# EAGLE design harp timestamp generator (EAGLE 9.6.2)
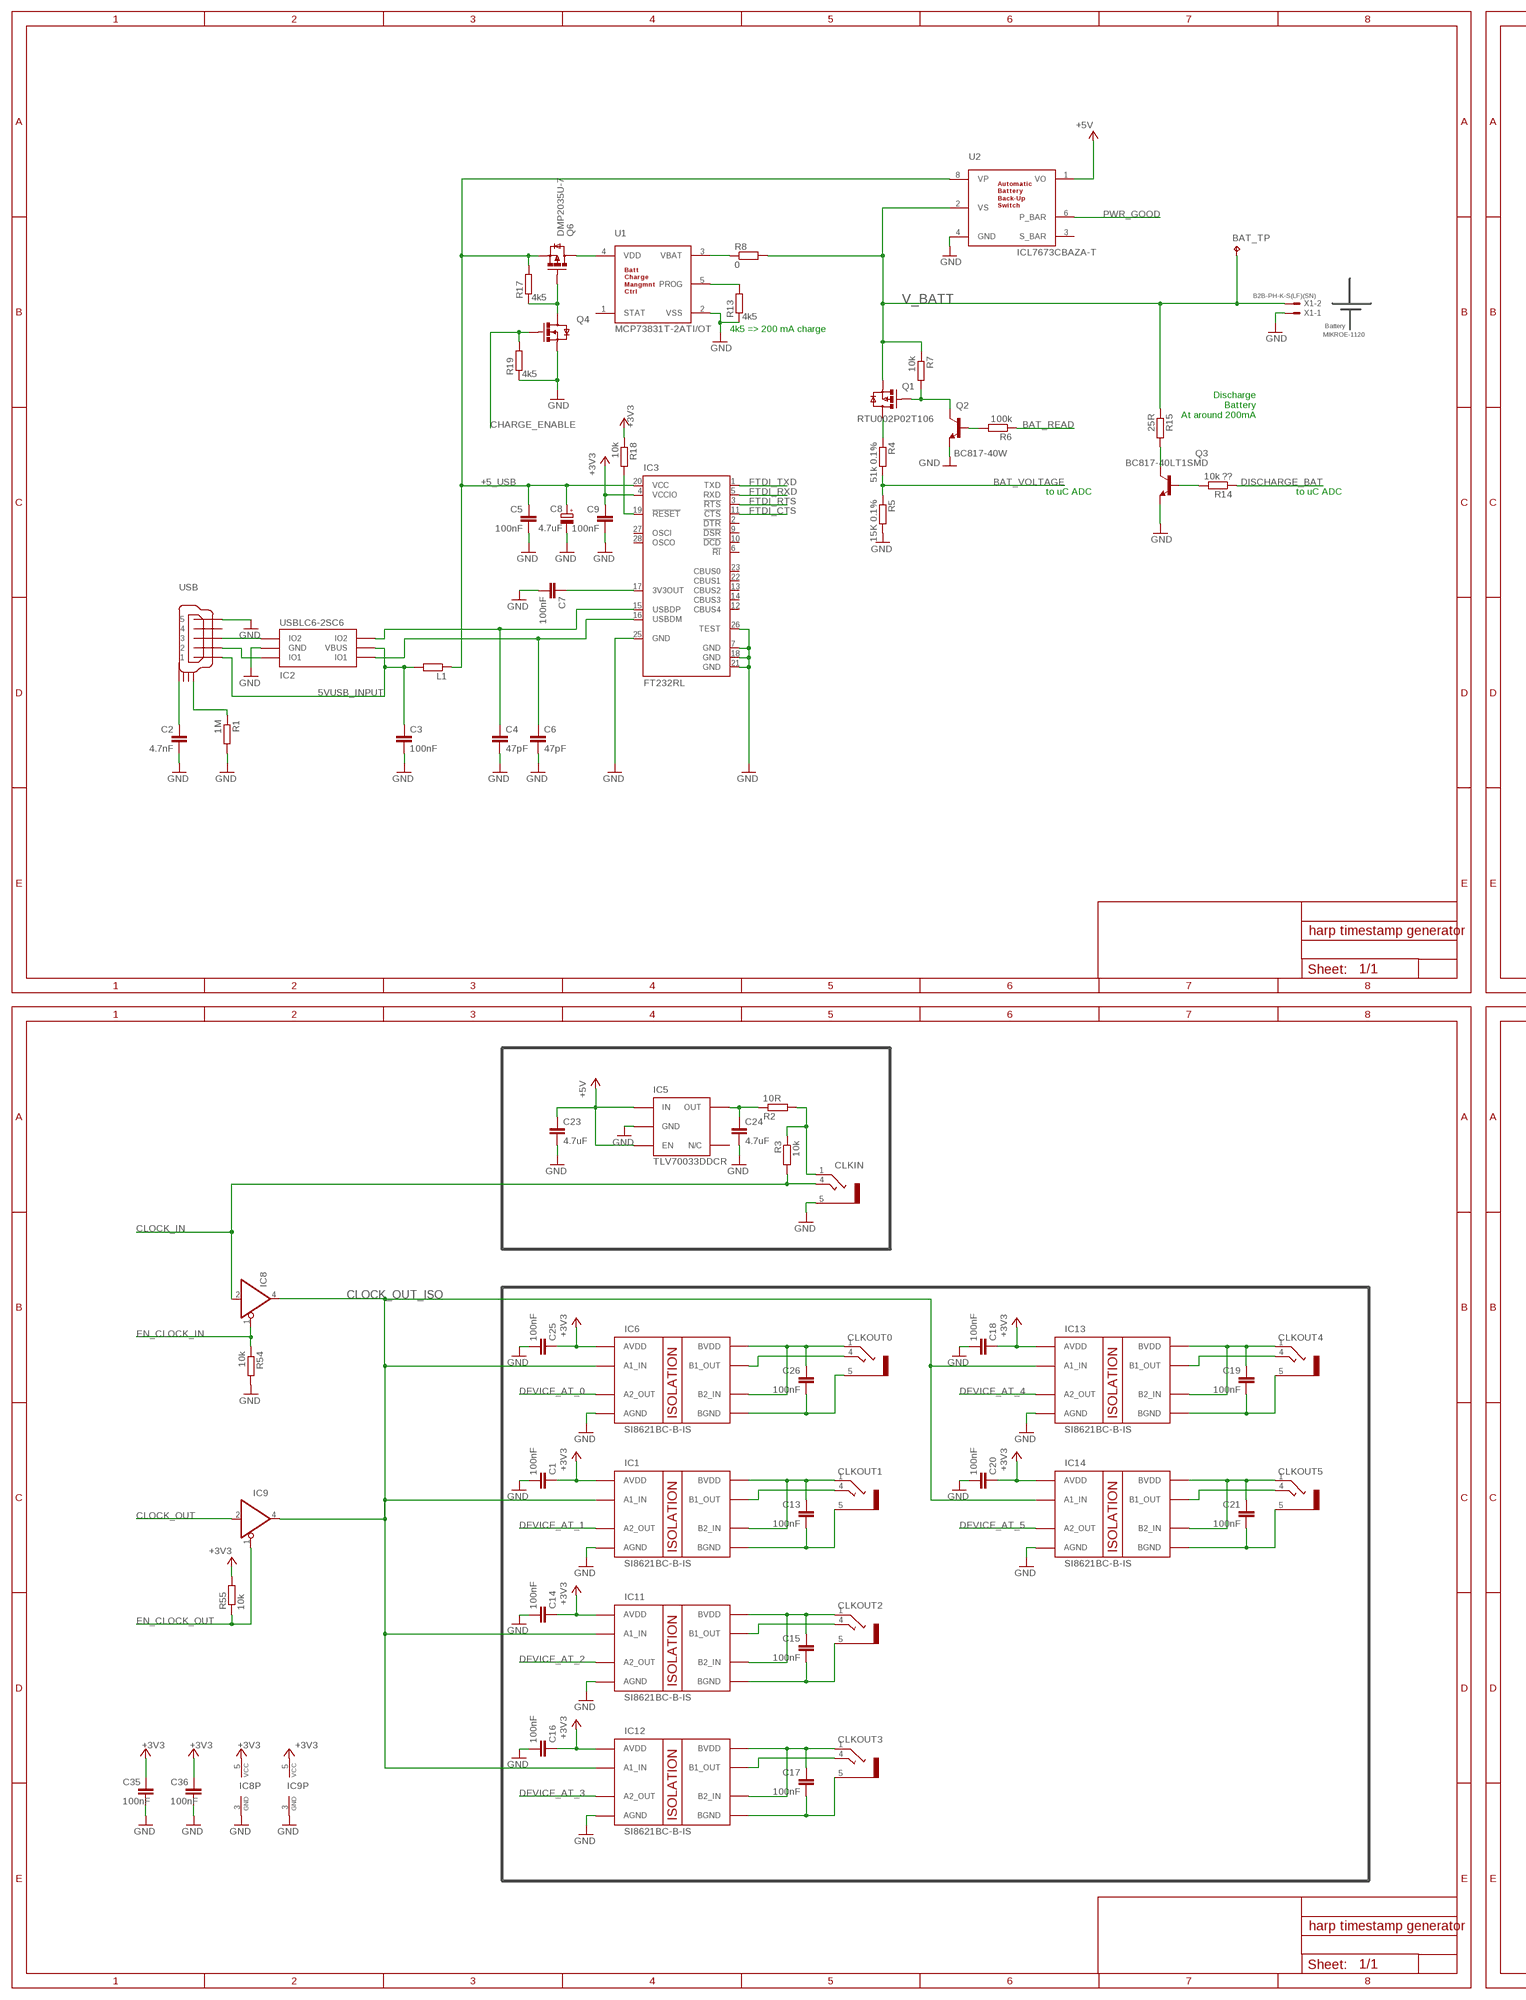
[diagram p0: schematic, sheet 1, part 1 of 3]
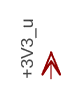
[diagram p1: schematic, sheet 1, part 2 of 3]
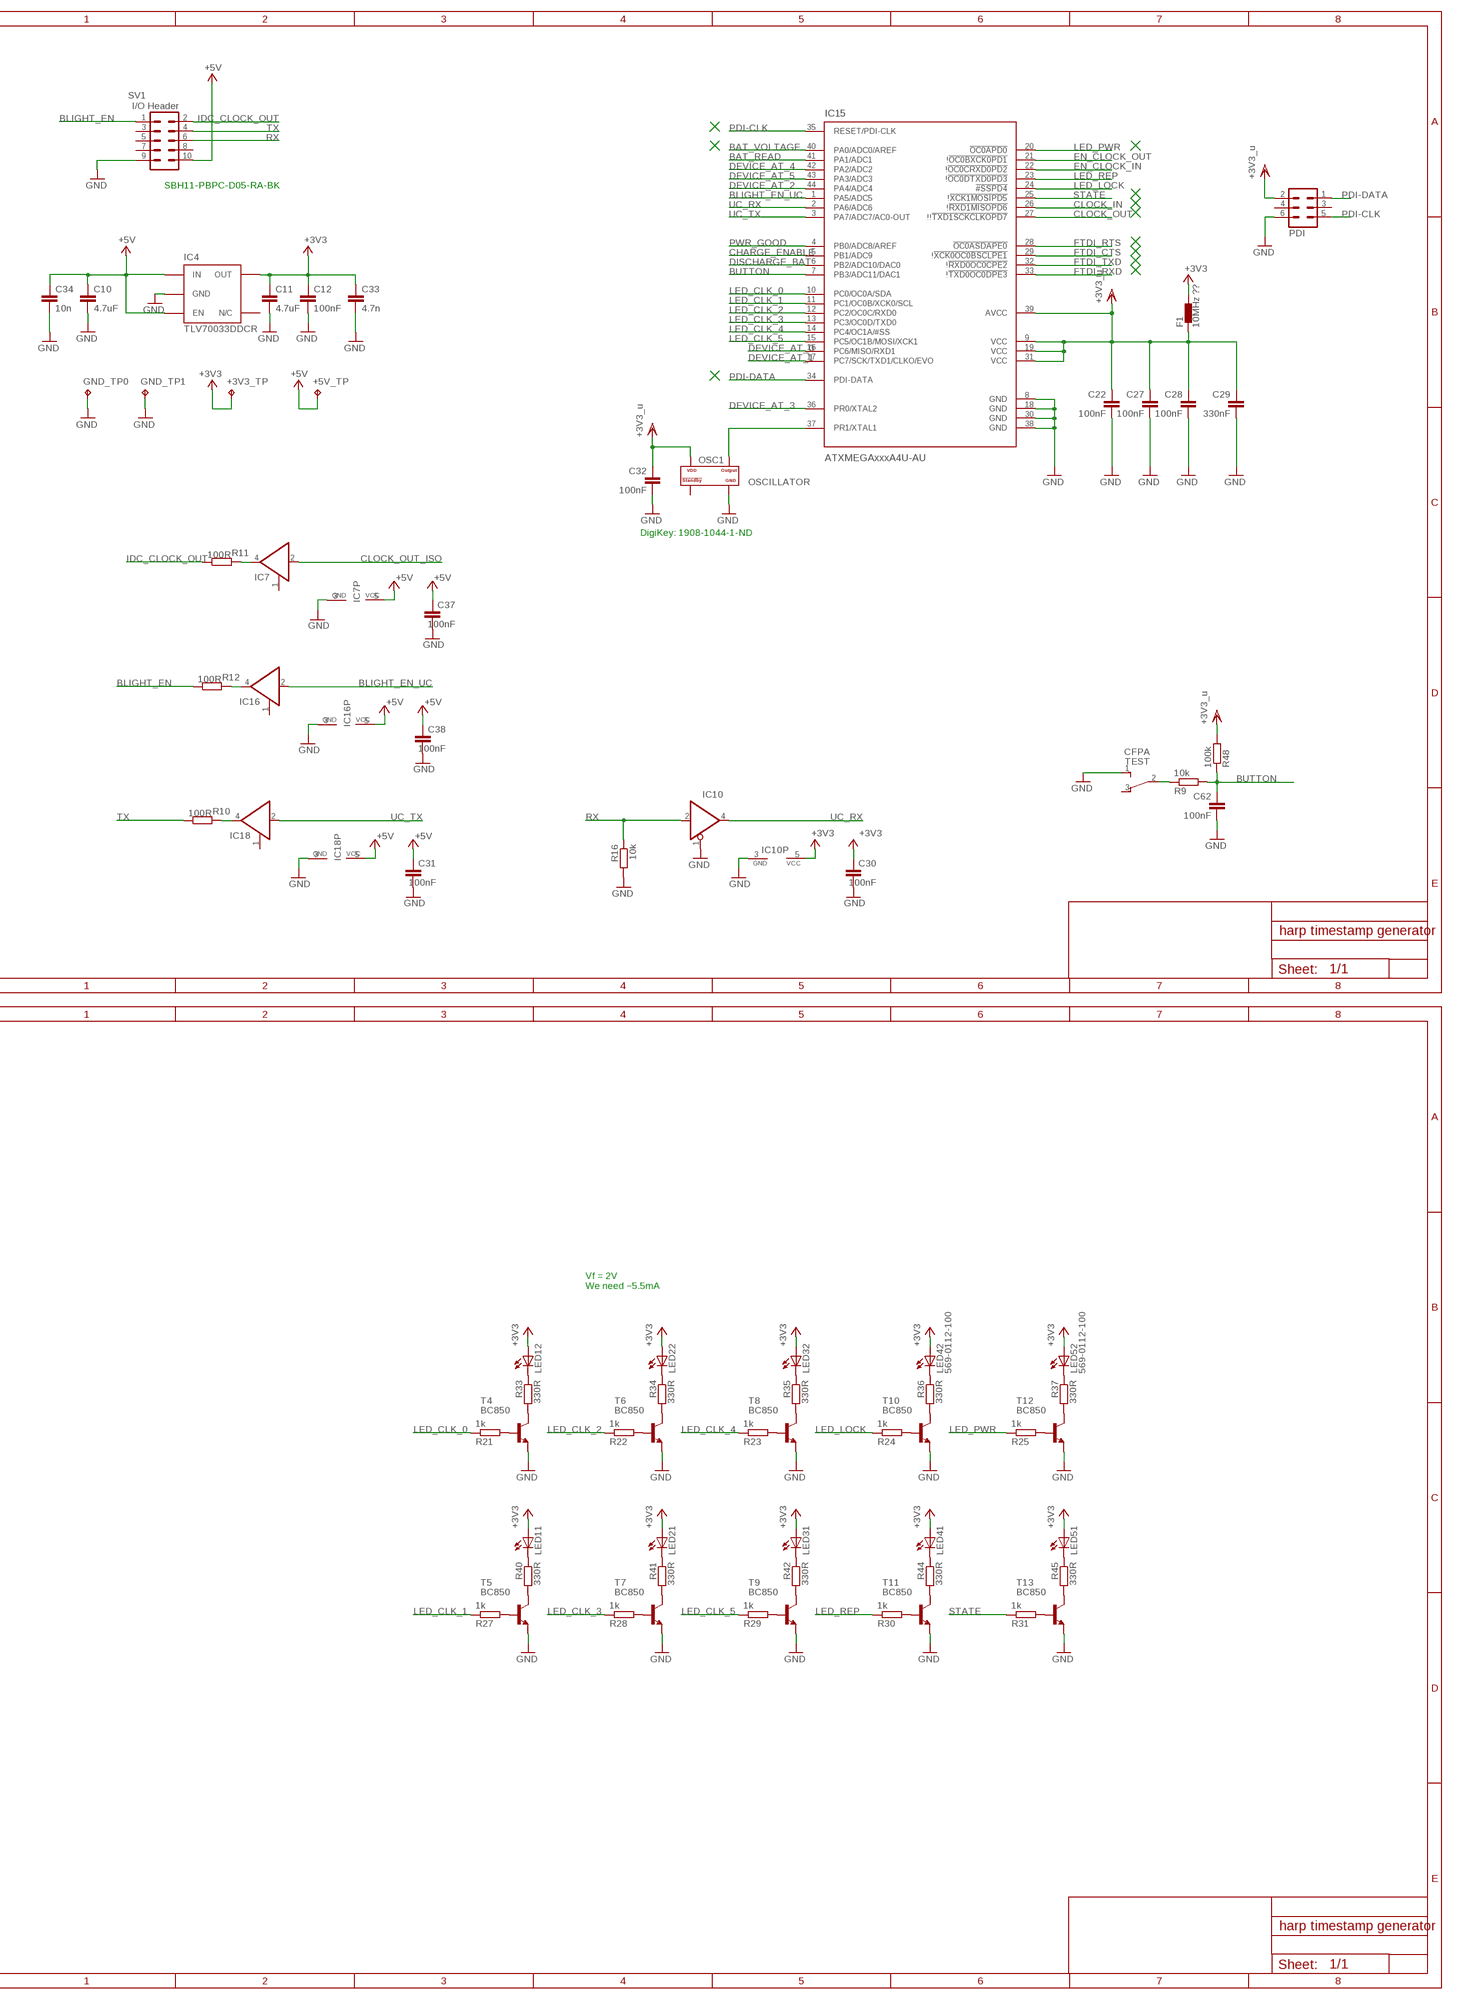
[diagram p2: schematic, sheet 1, part 3 of 3]

## Parts
+3V3_TP  TPPAD1-13  [P1-13]
+5V_TP  TPPAD1-13  [P1-13]
BAT_TP  TPPAD1-13  [P1-13]
C1  100nF  C-EUC0402  [C0402]
C2  4.7nF  C-EUC0402  [C0402]
C3  100nF  C-EUC0402  [C0402]
C4  47pF  C-EUC0402  [C0402]
C5  100nF  C-EUC0402  [C0402]
C6  47pF  C-EUC0402  [C0402]
C7  100nF  C-EUC0402  [C0402]
C8  4.7uF  CPOL-EUA/3216-18W  [A/3216-18W]
C9  100nF  C-EUC0402  [C0402]
C10  4.7uF  C-EUC0603  [C0603]
C11  4.7uF  C-EUC0603  [C0603]
C12  100nF  C-EUC0402  [C0402]
C13  100nF  C-EUC0402  [C0402]
C14  100nF  C-EUC0402  [C0402]
C15  100nF  C-EUC0402  [C0402]
C16  100nF  C-EUC0402  [C0402]
C17  100nF  C-EUC0402  [C0402]
C18  100nF  C-EUC0402  [C0402]
C19  100nF  C-EUC0402  [C0402]
C20  100nF  C-EUC0402  [C0402]
C21  100nF  C-EUC0402  [C0402]
C22  100nF  C-EUC0402  [C0402]
C23  4.7uF  C-EUC0603  [C0603]
C24  4.7uF  C-EUC0603  [C0603]
C25  100nF  C-EUC0402  [C0402]
C26  100nF  C-EUC0402  [C0402]
C27  100nF  C-EUC0402  [C0402]
C28  100nF  C-EUC0402  [C0402]
C29  330nF  C-EUC0402  [C0402]
C30  100nF  C-EUC0402  [C0402]
C31  100nF  C-EUC0402  [C0402]
C32  100nF  C-EUC0402  [C0402]
C33  4.7n  C-EUC0402  [C0402]
C34  10n  C-EUC0402  [C0402]
C35  100nF  C-EUC0402  [C0402]
C36  100nF  C-EUC0402  [C0402]
C37  100nF  C-EUC0402  [C0402]
C38  100nF  C-EUC0402  [C0402]
C62  100nF  C-EUC0402  [C0402]
CLKIN  CLCK_JACK  STEREO_JACK  [35RASMT2BHNTRX]
CLKOUT0  CLCK_JACK  STEREO_JACK  [35RASMT2BHNTRX]
CLKOUT1  CLCK_JACK  STEREO_JACK  [35RASMT2BHNTRX]
CLKOUT2  CLCK_JACK  STEREO_JACK  [35RASMT2BHNTRX]
CLKOUT3  CLCK_JACK  STEREO_JACK  [35RASMT2BHNTRX]
CLKOUT4  CLCK_JACK  STEREO_JACK  [35RASMT2BHNTRX]
CLKOUT5  CLCK_JACK  STEREO_JACK  [35RASMT2BHNTRX]
F1  10MHz ??  BLM15HF0603  [R0603]
GND_TP0  TPPAD1-13  [P1-13]
GND_TP1  TPPAD1-13  [P1-13]
IC1  SI8621BC-B-IS  [SOIC8]
IC2  USBLC6-2SC6  USBLC6-2  [SOT23-6L]
IC3  FT232RL  [SSOP28]
IC4  TLV70033DDCR  TLV700XX  [TSOT23-5]
IC5  TLV70033DDCR  TLV700XX  [TSOT23-5]
IC6  SI8621BC-B-IS  [SOIC8]
IC7  74AHC1G126DCK  [SC70-5]
IC8  SN74LVC1G125DBVT  74AHC1G125DBV  [SOT23-5]
IC9  SN74LVC1G125DBVT  74AHC1G125DBV  [SOT23-5]
IC10  SN74LVC1G125DBVT  74AHC1G125DBV  [SOT23-5]
IC11  SI8621BC-B-IS  [SOIC8]
IC12  SI8621BC-B-IS  [SOIC8]
IC13  SI8621BC-B-IS  [SOIC8]
IC14  SI8621BC-B-IS  [SOIC8]
IC15  ATXMEGAxxxA4U-AU  AT-XMEGA-XXA4-AU  [QFP80P1200X1200X120-44N]
IC16  74AHC1G126DCK  [SC70-5]
IC18  74AHC1G126DCK  [SC70-5]
L1  40R@100MHz  R-EU_R0805  [R0805]
LED1  569-0112-100  LED_2X_VERTICAL  [569-011X-X00_LED_ARRAY]
LED2  569-0112-100  LED_2X_VERTICAL  [569-011X-X00_LED_ARRAY]
LED3  569-0112-100  LED_2X_VERTICAL  [569-011X-X00_LED_ARRAY]
LED4  569-0112-100  LED_2X_VERTICAL  [569-011X-X00_LED_ARRAY]
LED5  569-0112-100  LED_2X_VERTICAL  [569-011X-X00_LED_ARRAY]
OSC1  OSCILLATOR  [OSCILLATOR_3.2X2.5]
PDI  MA03-2  [MA03-2]
Q1  RTU002P02T106  MOSFET-PCHANNEL-ROHM  [SOT323]
Q2  BC817-40W  BC817  [SOT323-BEC]
Q3  BC817-40LT1SMD  [SOT23-BEC]
Q4  DMG1012UW  [SOT323]
Q6  DMP2035U-7  [SOT323]
R1  1M  R-EU_R0402  [R0402]
R2  10R  R-EU_R0402  [R0402]
R3  10k  R-EU_R0402  [R0402]
R4  51k 0.1%  R-EU_R0402  [R0402]
R5  15K 0.1%  R-EU_R0402  [R0402]
R6  100k  R-EU_R0402  [R0402]
R7  10k  R-EU_R0402  [R0402]
R8  0  R-EU_R0402  [R0402]
R9  10k  R-EU_R0402  [R0402]
R10  100R  R-EU_R0603  [R0603]
R11  100R  R-EU_R0603  [R0603]
R12  100R  R-EU_R0603  [R0603]
R13  4k5  R-EU_R0402  [R0402]
R14  10k ??  R-EU_R0402  [R0402]
R15  25R  R-EU_R2512  [R2512]
R16  10k  R-EU_R0402  [R0402]
R17  4k5  R-EU_R0402  [R0402]
R18  10k  R-EU_R0402  [R0402]
R19  4k5  R-EU_R0402  [R0402]
R21  1k  R-EU_R0402  [R0402]
R22  1k  R-EU_R0402  [R0402]
R23  1k  R-EU_R0402  [R0402]
R24  1k  R-EU_R0402  [R0402]
R25  1k  R-EU_R0402  [R0402]
R27  1k  R-EU_R0402  [R0402]
R28  1k  R-EU_R0402  [R0402]
R29  1k  R-EU_R0402  [R0402]
R30  1k  R-EU_R0402  [R0402]
R31  1k  R-EU_R0402  [R0402]
R33  330R  R-EU_R0402  [R0402]
R34  330R  R-EU_R0402  [R0402]
R35  330R  R-EU_R0402  [R0402]
R36  330R  R-EU_R0402  [R0402]
R37  330R  R-EU_R0402  [R0402]
R40  330R  R-EU_R0402  [R0402]
R41  330R  R-EU_R0402  [R0402]
R42  330R  R-EU_R0402  [R0402]
R44  330R  R-EU_R0402  [R0402]
R45  330R  R-EU_R0402  [R0402]
R48  100k  R-EU_R0402  [R0402]
R54  10k  R-EU_R0402  [R0402]
R55  10k  R-EU_R0402  [R0402]
SV1  I/O Header  ML10L  [ML10L]
T4  BC850  [SOT23]
T5  BC850  [SOT23]
T6  BC850  [SOT23]
T7  BC850  [SOT23]
T8  BC850  [SOT23]
T9  BC850  [SOT23]
T10  BC850  [SOT23]
T11  BC850  [SOT23]
T12  BC850  [SOT23]
T13  BC850  [SOT23]
TEST  CFPA  SPDT_CFPA  [CFPA]
U1  MCP73831T-2ATI/OT  [TSOT23-5]
U2  ICL7673CBAZA-T  [SOIC8]
USB  mini USB  USB_MINI_B  [240-0002-1]
X1  B2B-PH-K-S(LF)(SN)  JST-XH-02-PIN-ROUND-PAD  [JST-XH-02-PACKAGE-ROUND-PAD]

## Nets
5VUSB_INPUT: C3.1 IC2.P$5(VBUS) L1.2 USB.P$1
+3V3: +3V3_TP.TP C1.1 C9.1 C11.1 C12.1 C14.1 C16.1 C18.1 C20.1 C25.1 C30.1 C33.1 C35.1 C36.1 F1.2 IC1.1(AVDD) IC3.4(VCCIO) IC4.5(OUT) IC6.1(AVDD) IC8.5(VCC) IC9.5(VCC) IC10.5(VCC) IC11.1(AVDD) IC12.1(AVDD) IC13.1(AVDD) IC14.1(AVDD) LED1.A1(1:A) LED1.A2(2:A) LED2.A1(1:A) LED2.A2(2:A) LED3.A1(1:A) LED3.A2(2:A) LED4.A1(1:A) LED4.A2(2:A) LED5.A1(1:A) LED5.A2(2:A) R18.1 R55.2
+5_USB: C5.1 C8.+ IC3.20(VCC) L1.1 Q6.1(S) R17.2 U2.8(VP)
+5V: +5V_TP.TP C10.1 C23.1 C31.1 C34.1 C37.1 C38.1 IC4.1(IN) IC4.3(EN) IC5.1(IN) IC5.3(EN) IC7.5(VCC) IC16.5(VCC) IC18.5(VCC) SV1.10 U2.1(VO)
BAT_READ: IC15.41(PA1/ADC1) R6.1
BAT_VOLTAGE: IC15.40(PA0/ADC0/AREF) R4.2 R5.1
BLIGHT_EN: R12.1 SV1.1
BLIGHT_EN_UC: IC15.1(PA5/ADC5) IC16.2(I)
BUTTON: C62.1 IC15.7(PB3/ADC11/DAC1) R9.2 R48.1
CHARGE_ENABLE: IC15.5(PB1/ADC9) Q4.2(G) R19.2
CLKOUT0: CLKOUT0.4 IC6.7(B1_OUT)
CLKOUT1: CLKOUT1.4 IC1.7(B1_OUT)
CLKOUT2: CLKOUT2.4 IC11.7(B1_OUT)
CLKOUT3: CLKOUT3.4 IC12.7(B1_OUT)
CLKOUT4: CLKOUT4.4 IC13.7(B1_OUT)
CLKOUT5: CLKOUT5.4 IC14.7(B1_OUT)
CLOCK_IN: CLKIN.4 IC8.2(I) IC15.26(!!RXD1MISOPD6) R3.2
CLOCK_OUT: IC9.2(I) IC15.27(!!!TXD1SCKCLKOPD7)
CLOCK_OUT_ISO: IC1.2(A1_IN) IC6.2(A1_IN) IC7.2(I) IC8.4(O) IC9.4(O) IC11.2(A1_IN) IC12.2(A1_IN) IC13.2(A1_IN) IC14.2(A1_IN)
DEVICE_AT_0: IC6.3(A2_OUT) IC15.16(PC6/MISO/RXD1)
DEVICE_AT_1: IC1.3(A2_OUT) IC15.17(PC7/SCK/TXD1/CLKO/EVO)
DEVICE_AT_2: IC11.3(A2_OUT) IC15.44(PA4/ADC4)
DEVICE_AT_3: IC12.3(A2_OUT) IC15.36(PR0/XTAL2)
DEVICE_AT_4: IC13.3(A2_OUT) IC15.42(PA2/ADC2)
DEVICE_AT_5: IC14.3(A2_OUT) IC15.43(PA3/ADC3)
DISCHARGE_BAT: IC15.6(PB2/ADC10/DAC0) R14.1
EN_CLOCK_IN: IC8.1(OE) IC15.22(!!OC0CRXD0PD2) R54.1
EN_CLOCK_OUT: IC9.1(OE) IC15.21(!!OC0BXCK0PD1) R55.1
FTDI_CTS: IC3.11(!CTS) IC15.29(!!XCK0OC0BSCLPE1)
FTDI_RTS: IC3.3(!RTS) IC15.28(!OC0ASDAPE0)
FTDI_RXD: IC3.5(RXD) IC15.33(!!TXD0OC0DPE3)
FTDI_TXD: IC3.1(TXD) IC15.32(!!RXD0OC0CPE2)
GND: C1.2 C2.2 C3.2 C4.2 C5.2 C6.2 C7.2 C8.- C9.2 C10.2 C11.2 C12.2 C14.2 C16.2 C18.2 C20.2 C22.2 C23.2 C24.2 C25.2 C27.2 C28.2 C29.2 C30.2 C31.2 C32.2 C33.2 C34.2 C35.2 C36.2 C37.2 C38.2 C62.2 CLKIN.5 GND_TP0.TP GND_TP1.TP IC1.4(AGND) IC2.P$2(GND) IC3.7(GND) IC3.18(GND) IC3.21(GND) IC3.25(GND) IC3.26(TEST) IC4.2(GND) IC5.2(GND) IC6.4(AGND) IC7.3(GND) IC8.3(GND) IC9.3(GND) IC10.1(OE) IC10.3(GND) IC11.4(AGND) IC12.4(AGND) IC13.4(AGND) IC14.4(AGND) IC15.8(GND) IC15.18(GND) IC15.30(GND) IC15.38(GND) IC16.3(GND) IC18.3(GND) OSC1.P$2(GND) PDI.6 Q2.E Q3.E Q4.1(S) R1.2 R5.2 R13.1 R16.2 R19.1 R54.2 SV1.9 T4.2(E) T5.2(E) T6.2(E) T7.2(E) T8.2(E) T9.2(E) T10.2(E) T11.2(E) T12.2(E) T13.2(E) TEST.1 U1.2(VSS) U2.4(GND) USB.P$5 X1.1
GND_ISO: C26.2 CLKOUT0.5 IC6.5(BGND)
GND_ISO1: C13.2 CLKOUT1.5 IC1.5(BGND)
GND_ISO2: C15.2 CLKOUT2.5 IC11.5(BGND)
GND_ISO3: C17.2 CLKOUT3.5 IC12.5(BGND)
GND_ISO4: C19.2 CLKOUT4.5 IC13.5(BGND)
GND_ISO5: C21.2 CLKOUT5.5 IC14.5(BGND)
IDC_CLOCK_OUT: R11.1 SV1.2
LED_CLK_0: IC15.10(PC0/OC0A/SDA) R21.1
LED_CLK_1: IC15.11(PC1/OC0B/XCK0/SCL) R27.1
LED_CLK_2: IC15.12(PC2/OC0C/RXD0) R22.1
LED_CLK_3: IC15.13(PC3/OC0D/TXD0) R28.1
LED_CLK_4: IC15.14(PC4/OC1A/#SS) R23.1
LED_CLK_5: IC15.15(PC5/OC1B/MOSI/XCK1) R29.1
LED_LOCK: IC15.24(!#SSPD4) R24.1
LED_PWR: IC15.20(!OC0APD0) R25.1
LED_REP: IC15.23(!!OC0DTXD0PD3) R30.1
N$1: R24.2 T10.1(B)
N$2: Q4.3(D) Q6.2(G) R17.1
N$3: IC16.4(O) R12.2
N$4: IC18.4(O) R10.2
N$5: C26.1 CLKOUT0.1 IC6.6(B2_IN) IC6.8(BVDD)
N$6: C13.1 CLKOUT1.1 IC1.6(B2_IN) IC1.8(BVDD)
N$7: R36.2 T10.3(C)
N$8: IC7.4(O) R11.2
N$10: Q6.3(D) U1.4(VDD)
N$11: C15.1 CLKOUT2.1 IC11.6(B2_IN) IC11.8(BVDD)
N$15: R22.2 T6.1(B)
N$16: R13.2 U1.5(PROG)
N$17: R21.2 T4.1(B)
N$18: LED3.C1(1:C) R42.1
N$19: R33.2 T4.3(C)
N$20: R27.2 T5.1(B)
N$21: R34.2 T6.3(C)
N$22: R40.2 T5.3(C)
N$23: LED3.C2(2:C) R35.1
N$24: R28.2 T7.1(B)
N$25: R41.2 T7.3(C)
N$26: R23.2 T8.1(B)
N$27: R35.2 T8.3(C)
N$28: R29.2 T9.1(B)
N$29: R42.2 T9.3(C)
N$30: LED1.C2(2:C) R33.1
N$31: LED2.C2(2:C) R34.1
N$32: LED1.C1(1:C) R40.1
N$33: LED2.C1(1:C) R41.1
N$34: R30.2 T11.1(B)
N$35: Q3.B R14.2
N$36: Q3.C R15.2
N$37: C17.1 CLKOUT3.1 IC12.6(B2_IN) IC12.8(BVDD)
N$38: C7.1 IC3.17(3V3OUT)
N$40: IC2.P$1(IO1) USB.P$2
N$41: CLKIN.1 R2.2 R3.1
N$42: C24.1 IC5.5(OUT) R2.1
N$43: R9.1 TEST.2
N$45: C19.1 CLKOUT4.1 IC13.6(B2_IN) IC13.8(BVDD)
N$47: R44.2 T11.3(C)
N$49: C21.1 CLKOUT5.1 IC14.6(B2_IN) IC14.8(BVDD)
N$50: IC2.P$3(IO2) USB.P$3
N$53: R25.2 T12.1(B)
N$54: R37.2 T12.3(C)
N$56: R31.2 T13.1(B)
N$59: C2.1 USB.SHIELD_4
N$60: R45.2 T13.3(C)
N$61: R1.1 USB.SHIELD_1
N$62: LED5.C1(1:C) R45.1
N$63: LED5.C2(2:C) R37.1
N$65: LED4.C2(2:C) R36.1
N$66: LED4.C1(1:C) R44.1
N$97: R8.1 U1.3(VBAT)
N$113: Q1.3(D) R4.1
N$116: Q1.2(G) Q2.C R7.2
N$118: Q2.B R6.2
N$175: IC3.19(!RESET) R18.2
OSC1: IC15.37(PR1/XTAL1) OSC1.P$3(OUTPUT)
PDI-CLK: IC15.35(RESET/PDI-CLK) PDI.5
PDI-DATA: IC15.34(PDI-DATA) PDI.1
PWR_GOOD: IC15.4(PB0/ADC8/AREF) U2.6(P_BAR)
RX: IC10.2(I) R16.1 SV1.6
STATE: IC15.25(!!XCK1MOSIPD5) R31.1
TX: R10.1 SV1.4
UC_RX: IC10.4(O) IC15.2(PA6/ADC6)
UC_TX: IC15.3(PA7/ADC7/AC0-OUT) IC18.2(I)
USBDM: C6.1 IC2.P$6(IO1) IC3.16(USBDM)
USBDP: C4.1 IC2.P$4(IO2) IC3.15(USBDP)
V_BATT: BAT_TP.TP Q1.1(S) R7.1 R8.2 R15.1 U2.2(VS) X1.2
VDD: C22.1 C27.1 C28.1 C29.1 C32.1 F1.1 IC15.9(VCC) IC15.19(VCC) IC15.31(VCC) IC15.39(AVCC) OSC1.P$4(VDD) PDI.2 R48.2 ; supply symbol labelled +3V3_u
Unconnected: IC3.2(!DTR) IC3.6(!RI) IC3.9(!DSR) IC3.10(!DCD) IC3.12(CBUS4) IC3.13(CBUS2) IC3.14(CBUS3) IC3.22(CBUS1) IC3.23(CBUS0) IC3.27(OSCI) IC3.28(OSCO) IC4.4(N/C) IC5.4(N/C) IC7.1(OE) IC16.1(OE) IC18.1(OE) OSC1.P$1(STANDBY#) PDI.3 PDI.4 SV1.3 SV1.5 SV1.7 SV1.8 TEST.3 U1.1(STAT) U2.3(S_BAR) U2.5(NC5) U2.7(NC7) USB.P$4 USB.SHIELD_2 USB.SHIELD_3

## Notes on the sheet
- SBH11-PBPC-D05-RA-BK
- Battery
- 4k5 => 200 mA charge
- MIKROE-1120
- Discharge
  Battery
  At around 200mA
- to uC ADC | to uC ADC
- DigiKey: 1908-1044-1-ND
- Vf = 2V
  We need ~5.5mA

## Library data of the parts
+3V3_TP +5V_TP BAT_TP GND_TP0 GND_TP1 = testpad:TP: Test pad; MPN: n.a.
C1 C3 C5 C7 C9 C12-C21 C25 C26 C30 C31 C35-C38 = rcl:C-EU: CAPACITOR, European symbol; MPN: MC0402B104K160CT
C2 = rcl:C-EU: CAPACITOR, European symbol; MPN: 885012205084
C4 C6 = rcl:C-EU: CAPACITOR, European symbol; MPN: 04025A470JAT2A
C8 = rcl:CPOL-EU: POLARIZED CAPACITOR, European symbol; MPN: TAJA475K016UNJ
C10 C11 C23 C24 = rcl:C-EU: CAPACITOR, European symbol; MPN: C1608X6S1C475K080AC
C22 C27-C29 C32 C62 = rcl:C-EU: CAPACITOR, European symbol
C33 C34 = rcl:C-EU: CAPACITOR, European symbol; MPN: ??
CLKIN CLKOUT0 CLKOUT1-CLKOUT5 = harp timestamp generator:STEREO_JACK; MPN: 35RASMT2BHNTRX
F1 = harp timestamp generator:BLM15H: EMIFIL (R) Chip Ferrite Bead for GHz Noise Source: http://www.murata.com/ Ferrite Bead BLM15H.pdf
IC1 IC6 IC11-IC14 = harp timestamp generator:SI8621BC-B-IS; MPN: Si8621BC-B-IS
IC2 = harp timestamp generator:USBLC6-2; MPN: USBLC6-2SC6
IC3 = harp timestamp generator:FT232R: UART/FIFO IC; MPN: FT232RL-REEL
IC4 IC5 = harp timestamp generator:TLV700XX; MPN: TLV70033DDCR
IC7 IC16 IC18 = 74xx-little-de:74*1G126: Single Bus Buffer Gate With 3-State Outputs
IC8-IC10 = 74xx-little-de:74*1G125: Single Bus Buffer Gate with 3-State Output; MPN: SN74LVC1G125DBVT
IC15 = harp timestamp generator:AT-XMEGA-XXA4-AU: ATxMega a4 Serie
L1 = rcl:R-EU_: RESISTOR, European symbol; MPN: MI0805K400R-10
LED1-LED5 = harp timestamp generator:LED_2X; MPN: 5690-111-100F
OSC1 = harp timestamp generator:OSCILLATOR
PDI = con-lstb:MA03-2: PIN HEADER; OC_FARNELL: unknown; OC_NEWARK: unknown
Q1 = harp timestamp generator:MOSFET-PCHANNEL-ROHM: PMOS (RTU002P02) Low On-Resistance. Low Gate Threshold Voltage. Low Input Capacitance. Fast Switching Speed. Manufacturer: ROHM
Q2 Q3 = transistor-npn:BC817*: NPN Transistor
Q4 = harp timestamp generator:DMG1012UW: DMG1012UW N-channel MOSFET Drain Source Voltage Vds: 20V Continuous Drain Current Id: 1A On Resistance Rds(on): 0.3ohm Transistor Case Style: SOT-323 Transistor Mounting: Surface Mount Rds(on) Test Voltage Vgs: 4.5V; MPN: DMG1012UW
Q6 = harp timestamp generator:DMP2035U-7: DMP2035U Diode Inc surface mount, P channel enhancement mode MOSFET in SOT-23 package This device features low on resistance, low input capacitance, fast switching speed and low input/output leakage thus it is ideal for high efficiency power management applications. Drain to source Voltage (Vds) of -20V Gate to source voltage (Vgs) of ±8V Continuous drain current (Id) -3.6A to 25°C Power dissipation (Pd) of 810mW Operating temperature range -55°C to 150°C Low on state resistance of 41mohm at Vgs -1.8V; MPN: DMP2035U-7
R1 = rcl:R-EU_: RESISTOR, European symbol; MPN: CRCW04021M00FKED
R2 = rcl:R-EU_: RESISTOR, European symbol; MPN: CRCW040210R0FKEDHP
R3-R8 R16 R18 R54 R55 = rcl:R-EU_: RESISTOR, European symbol; MPN: CRCW040210K0FKED
R9 R48 = rcl:R-EU_: RESISTOR, European symbol
R10-R12 = rcl:R-EU_: RESISTOR, European symbol; MPN: CRCW0603100RFKEAHP
R13 R17 R19 = rcl:R-EU_: RESISTOR, European symbol; MPN: 22k !!!
R14 R15 = rcl:R-EU_: RESISTOR, European symbol; MPN: ???
R21-R25 R27-R31 = rcl:R-EU_: RESISTOR, European symbol; MPN: CRCW04021K00FKED
R33-R37 R40-R42 R44 R45 = rcl:R-EU_: RESISTOR, European symbol; MPN: RC0402FR-07330RL
SV1 = harp timestamp generator:ML10L: HARTING; MPN: SBH11-PBPC-D05-RA-BK
T4-T13 = transistor:BC850: NPN TRANSISTOR; MPN: BC850C,215
TEST = harp timestamp generator:SPDT: SPDT Switch
U1 = harp timestamp generator:MCP73831T-2ATI/OT: Miniature Single-Cell, Fully Integrated Li-Ion, Li-Polymer Charge Management Controllers; MPN: MCP73831T-2ATI/OT
U2 = harp timestamp generator:ICL7673CBAZA-T
USB = harp timestamp generator:USB_MINI_B; MPN: UX60-MB-5S8
X1 = harp timestamp generator:JST-XH-02-PIN: JST XH Connector 2 Pin Wire to board connector. Pitch: 2,54 mm, (0.100") Number of pins: 2 Created by Rembrandt Electronics www.rembrandtelectronics.com

## Net classes
0 default: clearance 0.205 mm

## Board
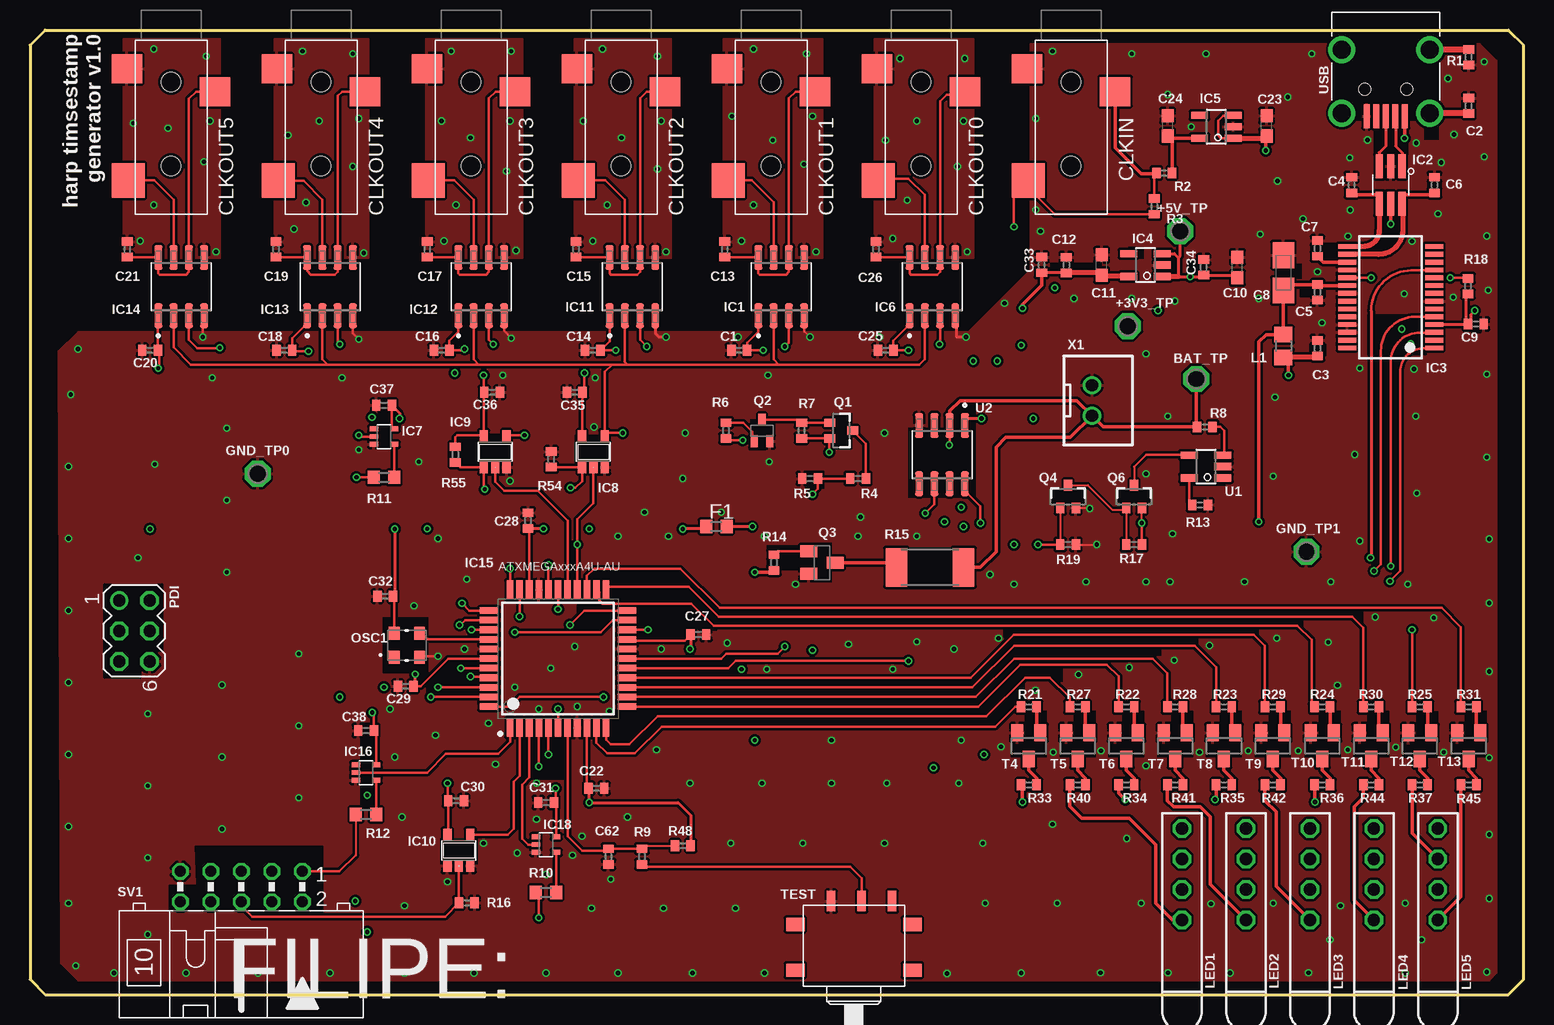
[diagram p3: board, top side]
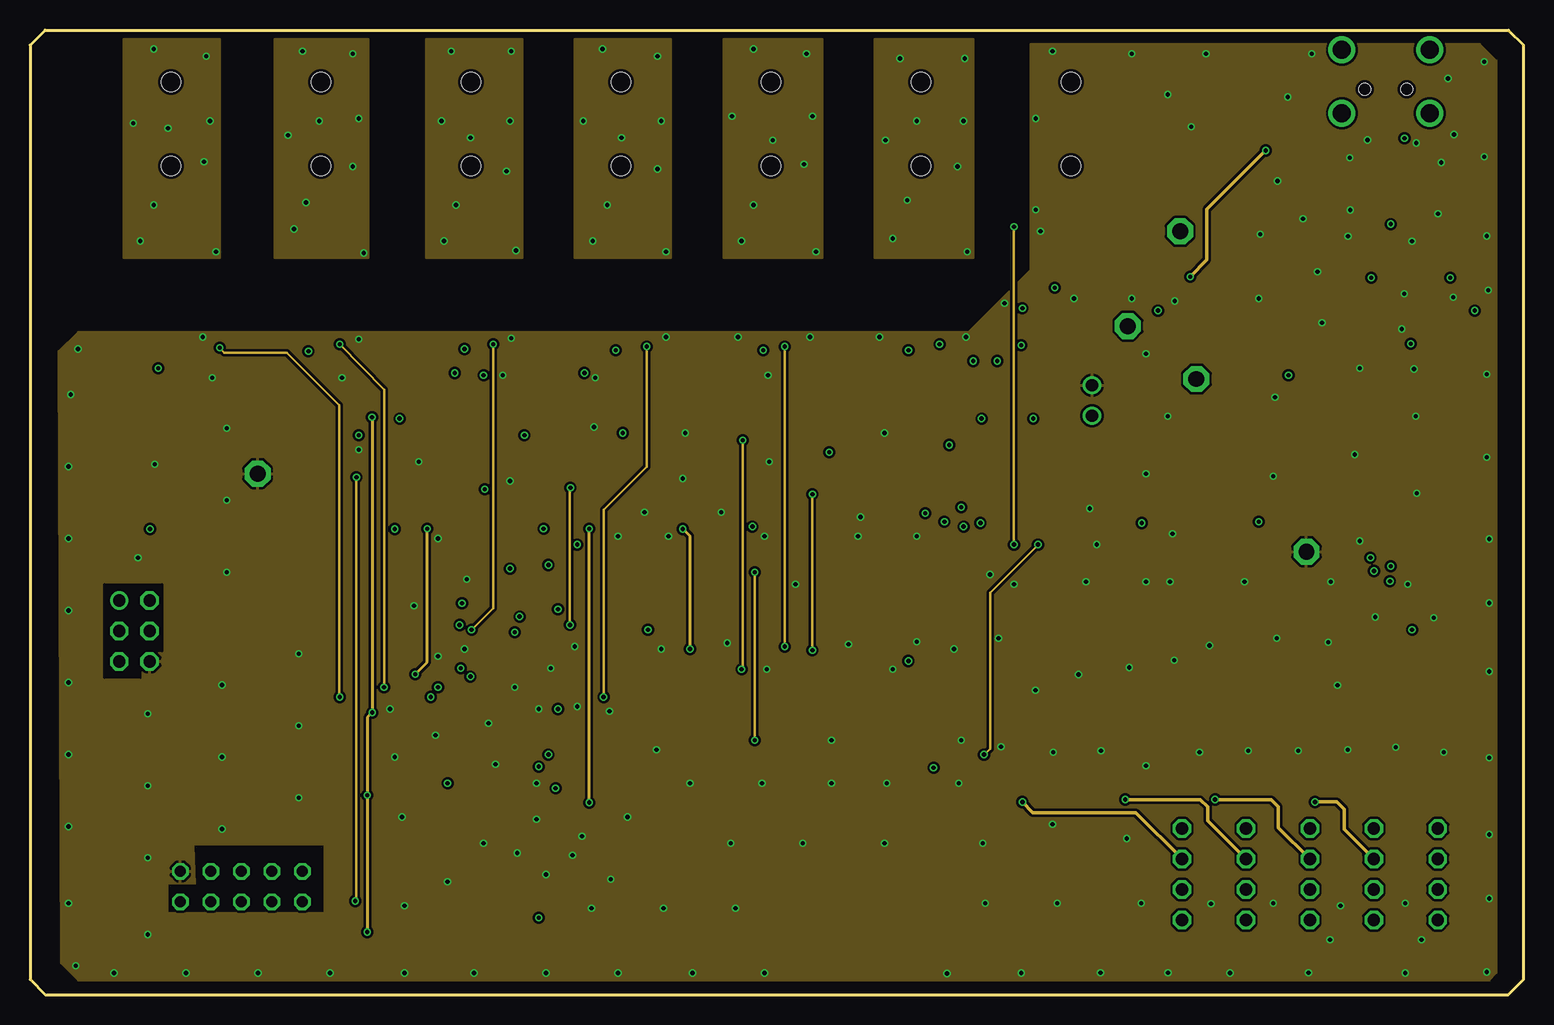
[diagram p4: board, inner layer Layer2]
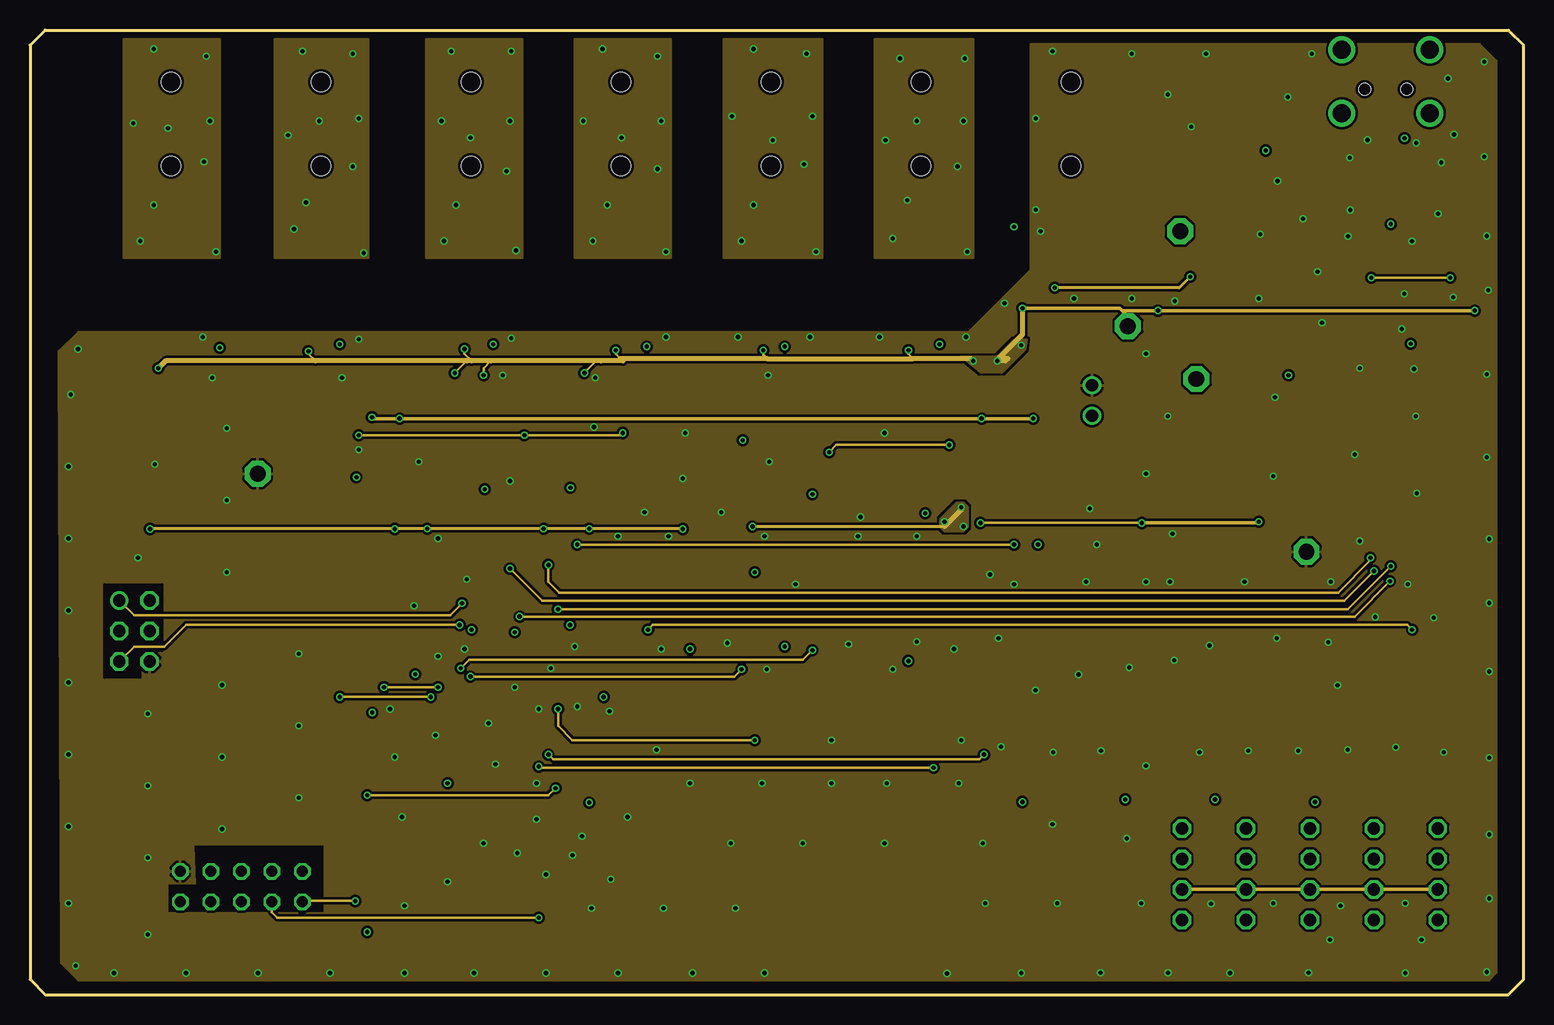
[diagram p5: board, inner layer Layer3]
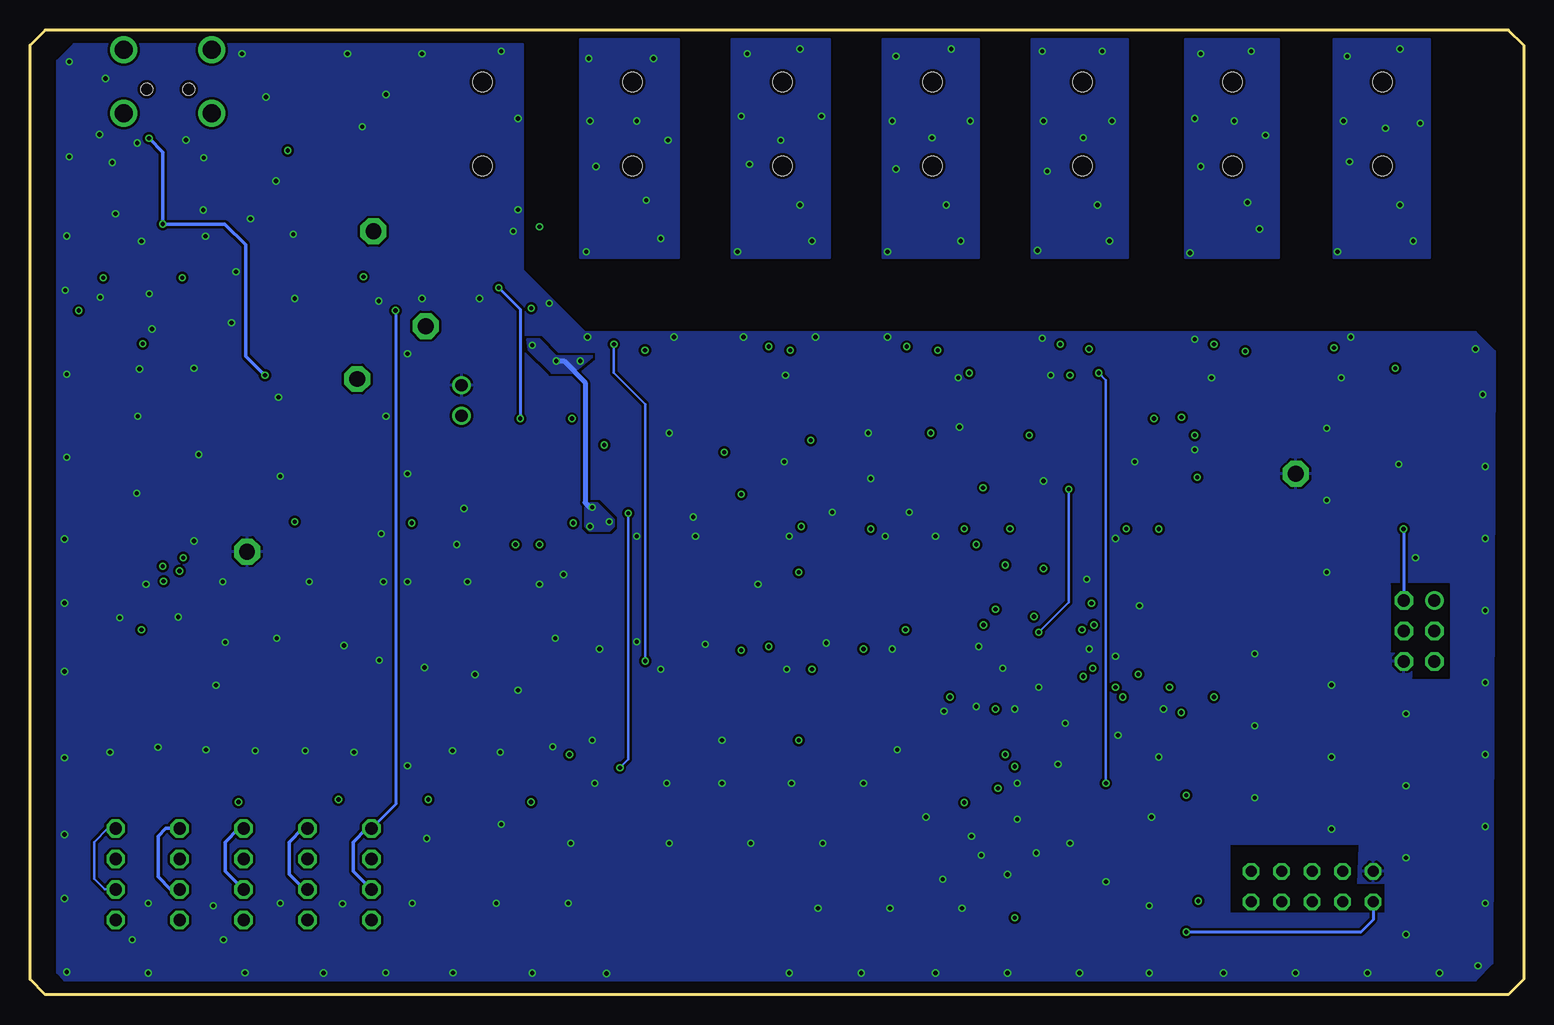
[diagram p6: board, bottom side, seen from below]

Size 124.46 x 80.38 mm. Coordinates in mm from the lower left corner, seen from the top.
Outline: 0,79.11 0,1.27 1.27,0 123.19,0 124.46,1.27 124.46,79.11 123.19,80.38 1.27,80.38 0,79.11
Copper layers (1+2*15+16): Top 0.018mm / dielectric 0.36mm / Layer2 0.035mm / dielectric 0.71mm / Layer3 0.035mm / dielectric 0.2mm / Bottom 0.018mm
Design rules "harp PCB design rules *": minimum track width 0.15mm, minimum drill 0.35mm, track to track 6mil, track to pad 6mil, pad to pad 6mil, via to via 6mil, smd to smd 6mil, copper to edge 0.25mm, drill to drill 0.35mm, minimum pad ring 0.175mm, minimum via ring 0.125mm, stop-mask expansion 0mil, vias tented up to drill 0.45mm, thermal gap 0.2mm
tKeepout: area 0,-0.5 to 2.5,79.5; area 122.4,0.5 to 125,80.5
bKeepout: area 122.4,0.5 to 125,80.5

### Footprints (pad centres in the part's own frame; a part is rotated, then mirrored left to right if it is on the bottom)
P1-13 = drill 1.321 pad 2.159 octagon: TP 0,0
C0402 = smd 0.7 x 0.9: 1 -0.65,0; 2 0.65,0
A/3216-18W = smd 2.15 x 1.8: + 1.475,0; - -1.475,0
C0603 = smd 1.1 x 1: 1 -0.85,0; 2 0.85,0
35RASMT2BHNTRX = smd 2.4 x 2.55: 1 0.8,3.675; 5 -1.1,-3.675 | smd 2.9 x 2.75: 4 8.2,-3.575 | hole 1.6: 0,0; 7,0
R0603 = smd 1 x 1.1: 1 -0.85,0; 2 0.85,0
SOIC8 = smd 0.67 x 2.07: 1 -1.905,-2.425; 2 -0.635,-2.425; 3 0.635,-2.425; 4 1.905,-2.425; 5 1.905,2.425; 6 0.635,2.425; 7 -0.635,2.425; 8 -1.905,2.425
SOT23-6L = smd 0.6 x 2: P$1 -0.95,-1.55; P$2 0,-1.55; P$3 0.95,-1.55; P$4 0.95,1.55; P$5 0,1.55; P$6 -0.95,1.55
SSOP28 = smd 0.4 x 1.5: 1 -4.225,-3.625; 2 -3.575,-3.625; 3 -2.925,-3.625; 4 -2.275,-3.625; 5 -1.625,-3.625; 6 -0.975,-3.625; 7 -0.325,-3.625; 8 0.325,-3.625; 9 0.975,-3.625; 10 1.625,-3.625; 11 2.275,-3.625; 12 2.925,-3.625; 13 3.575,-3.625; 14 4.225,-3.625; 15 4.225,3.625; 16 3.575,3.625; 17 2.925,3.625; 18 2.275,3.625; 19 1.625,3.625; 20 0.975,3.625; 21 0.325,3.625; 22 -0.325,3.625; 23 -0.975,3.625; 24 -1.625,3.625; 25 -2.275,3.625; 26 -2.925,3.625; 27 -3.575,3.625; 28 -4.225,3.625
TSOT23-5 = smd 0.6 x 1.408: 1 -0.95,-1.404; 2 0,-1.404; 3 0.95,-1.404; 4 0.95,1.404; 5 -0.95,1.404
SC70-5 = smd 0.4 x 0.7: 1 -0.65,-0.85; 2 0,-0.85; 3 0.65,-0.85; 4 0.65,0.85; 5 -0.65,0.85
SOT23-5 = smd 0.69 x 0.99: 1 -0.95,-1.29; 2 0,-1.29; 3 0.95,-1.29; 4 0.95,1.3; 5 -0.95,1.3
QFP80P1200X1200X120-44N = smd 1.55 x 0.55: 1 -5.75,4; 2 -5.75,3.2; 3 -5.75,2.4; 4 -5.75,1.6; 5 -5.75,0.8; 6 -5.75,0; 7 -5.75,-0.8; 8 -5.75,-1.6; 9 -5.75,-2.4; 10 -5.75,-3.2; 11 -5.75,-4; 23 5.75,-4; 24 5.75,-3.2; 25 5.75,-2.4; 26 5.75,-1.6; 27 5.75,-0.8; 28 5.75,0; 29 5.75,0.8; 30 5.75,1.6; 31 5.75,2.4; 32 5.75,3.2; 33 5.75,4 | smd 0.55 x 1.55: 12 -4,-5.75; 13 -3.2,-5.75; 14 -2.4,-5.75; 15 -1.6,-5.75; 16 -0.8,-5.75; 17 0,-5.75; 18 0.8,-5.75; 19 1.6,-5.75; 20 2.4,-5.75; 21 3.2,-5.75; 22 4,-5.75; 34 4,5.75; 35 3.2,5.75; 36 2.4,5.75; 37 1.6,5.75; 38 0.8,5.75; 39 0,5.75; 40 -0.8,5.75; 41 -1.6,5.75; 42 -2.4,5.75; 43 -3.2,5.75; 44 -4,5.75
R0805 = smd 1.3 x 1.5: 1 -0.95,0; 2 0.95,0
569-011X-X00_LED_ARRAY = drill 1.016 octagon: A1 -6.35,0; A2 -1.27,0; C1 -8.89,0; C2 -3.81,0
OSCILLATOR_3.2X2.5 = smd 0.9 x 1.1: P$1 -1.05,-1; P$2 1.05,-1; P$3 1.05,1; P$4 -1.05,1
MA03-2 = drill 1.016: 1 -2.54,-1.27 | drill 1.016 octagon: 2 -2.54,1.27; 3 0,-1.27; 4 0,1.27; 5 2.54,-1.27; 6 2.54,1.27
SOT323 = smd 0.7 x 0.9: 1 0.65,-0.95; 2 -0.65,-0.95; 3 0,0.95
SOT323-BEC = smd 0.6 x 1: B -0.65,-0.9; C 0,0.9; E 0.65,-0.9
SOT23-BEC = smd 1 x 1.4: B -0.95,-1.1; C 0,1.1; E 0.95,-1.1
R0402 = smd 0.7 x 0.9: 1 -0.65,0; 2 0.65,0
R2512 = smd 1.8 x 3.2: 1 -2.8,0; 2 2.8,0
ML10L = drill 0.914 octagon: 1 -5.08,-1.27; 2 -5.08,1.27; 3 -2.54,-1.27; 4 -2.54,1.27; 5 0,-1.27; 6 0,1.27; 7 2.54,-1.27; 8 2.54,1.27; 9 5.08,-1.27; 10 5.08,1.27
SOT23 = smd 1 x 1.4: 1 -0.95,-1.1; 2 0.95,-1.1; 3 0,1.1
CFPA = smd 1.7 x 0.7: 1 3.85,1.9; 2 3.85,-0.64; 3 3.85,-3.18 | smd 1.1 x 1.55: NC1 -1.905,4.875; NC2 -1.905,-4.875; NC3 1.905,-4.875; NC4 1.905,4.875
240-0002-1 = smd 0.5 x 2: P$1 -1.6,8.65; P$2 -0.8,8.65; P$3 0,8.65; P$4 0.8,8.65; P$5 1.6,8.65 | drill 1.5: SHIELD_1 -3.65,3.1; SHIELD_2 3.65,3.1; SHIELD_3 3.65,8.4; SHIELD_4 -3.65,8.4 | hole 1: -1.75,6.4; 1.75,6.4
JST-XH-02-PACKAGE-ROUND-PAD = drill 1.016: 1 -1.27,0; 2 1.27,0

### Placement (x,y rotation side)
+3V3_TP  91.49,55.71 0 top
+5V_TP  95.84,63.61 0 top
BAT_TP  97.2,51.3 180 top
C1  59.1,53.7 180 top
C2  119.89,74.06 90 top
C3  107.29,53.86 90 top
C4  110.13,67.46 90 top
C5  107.29,58.52 270 top
C6  117.04,67.46 90 top
C7  107.29,62.18 90 top
C8  104.45,60.15 270 top
C9  120.5,55.88 0 top
C10  100.62,60.59 90 top
C11  89.3,60.79 90 top
C12  86.36,60.79 90 top
C13  57.9,62.1 90 top
C14  46.9,53.7 180 top
C15  45.5,62.1 90 top
C16  34.3,53.7 180 top
C17  33.1,62.1 90 top
C18  21.2,53.7 180 top
C19  20.5,62.1 90 top
C20  10,53.7 180 top
C21  8.1,62.1 90 top
C22  47.2,17.2 0 top
C23  103.04,72.39 90 top
C24  94.81,72.39 90 top
C25  71.3,53.7 180 top
C26  70.5,62.1 90 top
C27  55.7,30 0 top
C28  41.5,39.5 90 top
C29  31.3,25.7 180 top
C30  35.5,16.16 0 top
C31  43,16 180 top
C32  29.6,33.2 180 top
C33  84.3,60.8 90 top
C34  97.8,60.6 90 top
C35  45.4,50.2 180 top
C36  38.5,50.2 0 top
C37  29.5,49.1 180 top
C38  28,22 180 top
C62  48.2,11.5 270 top
CLKIN  86.75,76.05 270 top
CLKOUT0  74.25,76.05 270 top
CLKOUT1  61.75,76.05 270 top
CLKOUT2  49.25,76.05 270 top
CLKOUT3  36.75,76.05 270 top
CLKOUT4  24.25,76.05 270 top
CLKOUT5  11.75,76.05 270 top
F1  57.2,39 0 top
GND_TP0  18.97,43.41 0 top
GND_TP1  106.37,36.91 0 top
IC1  62.6,59 0 top
IC2  113.39,67.46 180 top
IC3  113.39,58.12 90 top
IC4  92.96,60.79 90 top
IC5  98.86,72.32 90 top
IC6  75.2,59 0 top
IC7  29.5,46.5 270 top
IC8  46.95,45.23 0 top
IC9  38.76,45.23 0 top
IC10  35.73,12.01 0 top
IC11  50.2,59 0 top
IC12  37.6,59 0 top
IC13  25,59 0 top
IC14  12.6,59 0 top
IC15  44,28 90 top
IC16  28,18.5 270 top
IC18  43,12.5 270 top
L1  104.45,54.05 270 top
LED1  96,15.11 90 top
LED2  101.33,15.11 90 top
LED3  106.66,15.11 90 top
LED4  111.99,15.11 90 top
LED5  117.32,15.11 90 top
OSC1  31.4,29.1 0 top
PDI  8.7,30.3 270 top
Q1  67.6,47 270 top
Q2  61,47 0 top
Q3  66,36 270 top
Q4  86.5,41.5 0 top
Q6  92,41.5 0 top
R1  119.89,78.12 270 top
R2  94.52,68.46 180 top
R3  93.69,65.68 270 top
R4  69,43 180 top
R5  65,43 180 top
R6  58,47 90 top
R7  64.3,47 90 top
R8  97.9,47.3 180 top
R9  51,11.5 90 top
R10  43,8.5 0 top
R11  29.5,43.1 0 top
R12  28,15 0 top
R13  97.5,40.8 180 top
R14  62,36 90 top
R15  75,35.6 180 top
R16  36.39,7.64 0 top
R17  92,37.5 0 top
R18  119.84,59.03 90 top
R19  86.5,37.5 180 top
R21  83.24,23.98 0 top
R22  91.37,23.98 0 top
R23  99.5,23.98 0 top
R24  107.7,23.98 0 top
R25  115.82,23.98 0 top
R27  87.3,23.98 0 top
R28  95.43,23.98 0 top
R29  103.56,23.98 0 top
R30  111.76,23.98 0 top
R31  119.89,23.98 0 top
R33  83.24,17.48 0 top
R34  91.37,17.48 0 top
R35  99.5,17.48 0 top
R36  107.7,17.48 0 top
R37  115.82,17.48 0 top
R40  87.3,17.48 0 top
R41  95.43,17.48 0 top
R42  103.56,17.48 0 top
R44  111.76,17.48 0 top
R45  119.89,17.48 0 top
R48  54.4,12.4 0 top
R54  43.43,44.6 90 top
R55  35.45,45 90 top
SV1  17.61,9 180 top
T4  83.24,20.73 180 top
T5  87.3,20.73 180 top
T6  91.37,20.73 180 top
T7  95.43,20.73 180 top
T8  99.5,20.73 180 top
T9  103.56,20.73 180 top
T10  107.7,20.73 180 top
T11  111.76,20.73 180 top
T12  115.82,20.73 180 top
T13  119.89,20.73 180 top
TEST  68.66,3.94 90 top
U1  98,44 90 top
U2  76,45 180 top
USB  112.98,81.85 180 top
X1  88.5,49.5 270 top

### Tracks (layer width: path | path; a pad name or v marks a point on that pad's centre or on a via)
5VUSB_INPUT  (via drill 0.35)
  Top 0.305: v114.54,71.37 114.58,71.4 USB.P$1 | IC2.P$5 v113.39,64.21 | v104.88,51.6 104.85,51.63 104.85,52.7 L1.2
  Top 0.406: C3.1 107.18,53.1 L1.2
  Bottom 0.305: v114.54,71.37 113.39,70.21 v113.39,64.21 108.21,64.21 106.47,62.48 106.5,53.2 104.9,51.6 v104.88,51.6
+3V3  (via drill 0.35)
  Top 0.203: v73.21,53.7 C25.1 71.95,54.5 73.3,55.84 IC6.1 | v61.1,53.7 C1.1 59.75,54.3 60.7,55.24 IC1.1 | v48.81,53.7 C14.1 48.3,54.45 IC11.1 | IC8.5 46,49.15 C35.1 46.2,50.35 v46.2,51.8 | IC13.1 23.09,55.95 21.85,54.7 C18.1 21.95,53.6 v23.2,53.6 | v36.21,53.8 36.11,53.7 C16.1 34.95,54.5 35.7,55.24 IC12.1 | v10.7,52.2 10.75,52.25 10.75,53.6 C20.1 10.65,56.53 IC14.1 | R55.2 35.45,46.45 35.6,46.6 37.74,46.6 IC9.5 37.81,50.16 C36.1 37.8,50.25 v37.8,51.6 | IC10.5 34.85,13.38 C30.1 34.8,16.21 v34.8,17.6
  Top 0.254: 119.85,56 C9.1 119.85,55.84 IC3.4 | R18.1 119.65,58.19 119.65,55.8 119.85,56 | v120.4,57 120.05,56.65 120.05,56.2 119.85,56 | v60.2,39 F1.2 | C12.1 C33.1
  Top 0.305: C33.1 84.3,59.1 82.7,57.5 v82.7,57.2
  Top 0.406: IC4.5 89.4,59.84 | 89.1,60.15 C12.1
  Top 0.61: 89.4,59.84 C11.1 89.1,60.15
  Layer3 0.152: v61.1,53.7 61.1,53.3 61.4,53
  Layer3 0.203: v23.2,53.6 23.2,53.4 23.8,52.8 | 36.8,52.8 36.21,53.39 v36.21,53.8 | v48.81,53.7 48.81,53.39 49.2,53 49.4,52.8 | 73.6,53 73.21,53.39 v73.21,53.7 | v35.4,51.8 36.4,52.8 | v37.8,51.6 37.8,52.2 38.4,52.8 | 47.6,52.8 47.2,52.8 v46.2,51.8
  Layer3 0.254: 76.2,39 v60.2,39 | 78.4,53 v78.6,52.8
  Layer3 0.305: LED1.A1 LED2.A1 LED3.A1 LED4.A1 LED5.A1 | v82.7,57.2 90.8,57.2 91,57 | 91,57 v94,57 v120.4,57 | +3V3_TP.TP 91.49,56.51 91,57
  Layer3 0.406: v82.7,57.2 82.7,55 80.7,53 81.5,53 81.3,52.8 v80.6,52.8 | 49.2,53 61.4,53 73.6,53 78.4,53 | 49.4,52.8 47.6,52.8 38.4,52.8 36.8,52.8 36.4,52.8 23.8,52.8 11.3,52.8 v10.7,52.2 | v77.6,40.6 77.6,40.4 76.2,39
  Bottom 0.203: LED5.A1 118.24,8.76 119.13,9.65 119.13,12.7 117.98,13.84 LED5.A2 | v34.8,17.6 34.8,36.54 34.81,36.55 34.81,51.21 v35.4,51.8 | 101.6,8.76 LED2.A1
  Bottom 0.254: v94,57 94,15.84 LED1.A2
  Bottom 0.305: LED1.A2 96.39,13.84 97.54,12.7 97.54,10.29 96.01,8.76 LED1.A1 | LED2.A2 101.73,13.84 102.87,12.7 102.87,10.03 101.6,8.76 | LED3.A2 107.06,13.84 108.2,12.7 108.2,10.29 106.68,8.76 LED3.A1 | LED4.A1 112.75,8.76 113.79,9.8 113.79,13.21 113.16,13.84 LED4.A2
  Bottom 0.406: v80.6,52.8 80,52.8 78.2,51 78.2,41 77.8,40.6 v77.6,40.6
  other vias: 82.6,54.1 77.8,39 76.2,39.4
  pour Bottom: 82.95,53.75 81,51.8 79.21,51.8 77.56,53.2 80.6,53.2 82,54.6 83.04,54.6
  pour Layer3: 82.95,53.75 81,51.8 79.21,51.8 77.56,53.2 80.6,53.2 82,54.6 83.04,54.6
  pour Bottom: 77.2,41 75.8,39.6 75.8,39 76.2,38.6 77.8,38.6 78.2,39 78.2,40.6 77.8,41
  pour Layer3: 77.2,41 75.8,39.6 75.8,39 76.2,38.6 77.8,38.6 78.2,39 78.2,40.6 77.8,41
+5_USB  (via drill 0.35)
  Top 0.152: v92.65,39.3 Q6.1
  Top 0.203: v92.65,39.3 R17.2 | U2.8 77.91,41.98 79.2,40.68 v79.2,39.3
  Top 0.305: C5.1 104.95,59.17 | C8.+ L1.1 103,55 102.4,54.4 v102.4,39.4 | IC3.20 107.29,59.09
  Top 0.406: 107.29,59.09 C5.1 | 104.95,59.17 C8.+
  Layer3 0.203: v92.65,39.3 v79.2,39.3
  Layer3 0.305: v92.65,39.3 102.3,39.3 v102.4,39.4
+5V  (via drill 0.35)
  Top 0.203: IC5.3 99.8,73.27 99.78,73.25 99.45,73.25 99,72.8 99,71.6 99.23,71.37 IC5.1 | C37.1 30.15,47.35 IC7.5 | IC18.5 43.85,15.8 C31.1 43.8,16.15 v43.8,17.2 | IC16.5 28.85,21.8 C38.1 28.65,23.35 28.5,23.5 v28.52,23.5
  Top 0.254: C37.1 30.8,48.45 v30.8,48 | v79.3,48 77.98,48 77.91,47.92 U2.1 | IC4.3 95.36,61.74 95.7,61.4 | 95.7,61.4 95.7,59.84 95.72,59.82 v96.68,59.82 97.67,59.82 C34.1 100.42,59.95 100.52,59.84 | 95.7,61.4 95.84,61.54 +5V_TP.TP
  Top 0.305: v102.98,70.34 102.98,71.48 C23.1
  Top 0.406: IC4.1 95.7,59.84 | C23.1 103.04,71.37 IC5.1
  Top 0.61: 100.52,59.84 C10.1
  Layer2 0.203: 28.11,16.8 v28.11,16.6
  Layer2 0.254: v28.5,48.1 28.52,48.09 v28.52,23.5 28.11,23.1 28.11,16.8 | v28.11,16.6 v28.11,5.21
  Layer2 0.305: v96.68,59.82 98.08,61.22 98.08,65.44 v102.98,70.34
  Layer3 0.203: v28.11,16.6 43.2,16.6 v43.8,17.2
  Layer3 0.254: v96.68,59.82 95.75,58.9 v85.4,58.9
  Layer3 0.305: v28.5,48.1 28.6,48 v30.8,48 v79.3,48 v83.6,48
  Bottom 0.254: v28.11,5.21 28.1,5.23 13.53,5.23 12.53,6.23 SV1.10 | v85.4,58.9 83.6,57.1 v83.6,48
BAT_READ  (via drill 0.35)
  Top 0.203: v59.4,46.2 58.15,46.2 R6.1 | v36.7,26.5 38.15,26.5 IC15.41
  Layer2 0.203: v59.4,46.2 59.4,27.2 v59.3,27.1
  Layer3 0.203: v59.3,27.1 58.7,26.5 v36.7,26.5
BAT_VOLTAGE  (via drill 0.35)
  Top 0.203: R4.2 R5.1 65.65,42.15 v65.2,41.7 | v35.9,27.2 IC15.40
  Layer2 0.203: v65.2,41.7 v65.2,28.7
  Layer3 0.203: v65.2,28.7 64.4,27.9 36.6,27.9 v35.9,27.2
BLIGHT_EN
  Top 0.152: R12.1 27.15,11.65 27.13,11.63
  Top 0.203: SV1.1 25.77,10.27 27.13,11.63
BLIGHT_EN_UC
  Top 0.203: IC16.2 33.1,18.5 34.65,20.05 39,20.05 40,21.05 IC15.1
BUTTON
  Top 0.203: IC15.7 44.8,13.2 46,12 48.05,12 C62.1 R9.2 51.2,12.35 R48.1
CHARGE_ENABLE  (via drill 0.35)
  Top 0.152: Q4.2 R19.2
  Top 0.203: IC15.5 v43.2,20 | v84,37.5 R19.2
  Layer2 0.203: v79.5,20 80,20.5 80,33.5 v84,37.5
  Layer3 0.203: v43.2,20 43.6,19.6 79.1,19.6 v79.5,20
CLKOUT0
  Top 0.203: IC6.7 74.56,66.64 73.2,68 70.83,68 CLKOUT0.4
CLKOUT1
  Top 0.203: IC1.7 61.97,66.03 60.15,67.85 CLKOUT1.4
CLKOUT2
  Top 0.203: IC11.7 49.56,66.23 47.95,67.85 CLKOUT2.4
CLKOUT3
  Top 0.203: IC12.7 36.97,66.23 35.35,67.85 CLKOUT3.4
CLKOUT4
  Top 0.203: IC13.7 24.36,66.23 22.8,67.8 20.73,67.8 CLKOUT4.4
CLKOUT5
  Top 0.203: CLKOUT5.4 10.35,67.85 11.96,66.23 IC14.7
CLOCK_IN  (via drill 0.35)
  Top 0.203: IC15.26 v45.6,37.5 45.6,39.6 46.95,40.95 IC8.2 | R3.2 85.4,65.03 83.18,67.25 83.18,67.8 | 83.18,67.8 CLKIN.4 | 83.18,67.8 81.99,66.61 v81.99,63.99
  Layer2 0.203: v82,37.5 v81.99,37.51 v81.99,63.99
  Layer3 0.203: v82,37.5 v45.6,37.5
CLOCK_OUT
  Top 0.203: IC15.27 44.8,39.5 42.3,42 39.5,42 38.76,42.74 IC9.2
CLOCK_OUT_ISO  (via drill 0.35)
  Top 0.203: IC8.4 47.9,46.8 | 47.9,46.8 47.9,51.9 48.5,52.5 | 48.5,52.5 37.4,52.5 | 37.4,52.5 24.8,52.5 | 24.8,52.5 13.4,52.5 11.96,53.94 IC14.2 | 62.4,52.5 49.8,52.5 | 49.8,52.5 48.5,52.5 | IC13.2 24.36,52.94 24.8,52.5 | IC12.2 36.97,52.94 37.4,52.5 | IC11.2 49.56,52.73 49.8,52.5 | IC1.2 61.97,52.94 62.4,52.5 | IC6.2 74.56,52.97 74.1,52.5 62.4,52.5 | IC7.2 27.5,46.5 v27.4,46.6 | v49.4,46.8 47.9,46.8 | IC9.4 39.81,46.63 41.17,46.63 v41.2,46.6
  Layer3 0.203: v27.4,46.6 v41.2,46.6 49.2,46.6 v49.4,46.8
DEVICE_AT_0  (via drill 0.35)
  Top 0.203: IC15.16 58.2,27.2 58.8,27.8 v73.2,27.8 | IC6.3 75.83,54.23 v75.8,54.2
  Bottom 0.203: v75.8,54.2 75.8,51.8 73.18,49.18 73.18,27.8 v73.2,27.8
DEVICE_AT_1  (via drill 0.35)
  Top 0.203: v62.9,29 62.3,28.4 58,28.4 57.6,28 IC15.17 | IC1.3 63.23,54.34 v62.9,54
  Layer2 0.203: v62.9,54 v62.9,29
DEVICE_AT_2  (via drill 0.35)
  Top 0.203: v47.8,24.8 40.8,24.8 40,24 IC15.44 | IC11.3 50.84,54.56 v51.4,54
  Layer2 0.203: v47.8,24.8 47.8,40.4 51.4,44 v51.4,54
DEVICE_AT_3  (via drill 0.35)
  Top 0.203: IC15.36 v36.8,30.4 | v38.6,54.2 38.23,54.56 IC12.3
  Layer2 0.203: v36.8,30.4 38.6,32.2 v38.6,54.2
DEVICE_AT_4  (via drill 0.35)
  Top 0.203: v34,25.6 IC15.42 | IC13.3 25.64,54.37 v25.8,54.2
  Layer2 0.203: v25.8,54.2 29.51,50.42 v29.51,25.61 v29.5,25.6
  Layer3 0.203: v29.5,25.6 v34,25.6
DEVICE_AT_5  (via drill 0.35)
  Top 0.203: v33.4,24.8 IC15.43 | v15.8,53.9 15.78,53.88 13.94,53.88 13.23,54.58 IC14.3
  Layer2 0.203: v15.8,53.9 16.2,53.5 21.4,53.5 25.78,49.12 25.78,24.82 v25.8,24.8
  Layer3 0.203: v33.4,24.8 v25.8,24.8
DISCHARGE_BAT  (via drill 0.35)
  Top 0.203: v44,23.8 IC15.6
  Top 0.305: R14.1 61.85,35.2 v60.4,35.2
  Layer2 0.203: v60.4,35.2 v60.4,21.2
  Layer3 0.203: v60.4,21.2 45.2,21.2 44,22.4 v44,23.8
EN_CLOCK_IN  (via drill 0.35)
  Top 0.203: v45.04,42.23 45.44,42.23 46,42.79 IC8.1 R54.1 | IC15.22 46.2,32 v45,30.8 v45,30.81
  Layer2 0.203: v45,30.81 v44.99,30.81 44.99,42.19 v45.04,42.23
EN_CLOCK_OUT  (via drill 0.35)
  Top 0.203: R55.1 35.86,43.94 IC9.1 37.81,42.21 37.8,42.2 v37.9,42.1 | IC15.21 48.56,31.2 47.56,30.2 v40.4,30.2
  Bottom 0.203: v37.9,42.1 37.9,32.7 v40.4,30.2
FTDI_CTS  (via drill 0.35)
  Top 0.203: 111.76,57 arc-90 115.11,60.35 116.97,60.35 IC3.11 | IC15.29 v43.2,35.8
  Top 0.254: 111.76,57 111.76,36.46 v111.7,36.4
  Layer3 0.203: v111.7,36.4 111.7,36.2 109,33.5 44.1,33.5 43.2,34.4 v43.2,35.8
FTDI_RTS  (via drill 0.35)
  Top 0.203: IC3.3 116.99,55.17 115.82,55.17 arc90 113.39,52.73 113.39,35.71 v113.4,35.7 | IC15.28 v44,32.11
  Layer3 0.203: v113.4,35.7 109.8,32.1 v44.01,32.1 v44,32.11
FTDI_RXD  (via drill 0.35)
  Top 0.203: IC3.5 115.42,56.49 arc90 112.57,53.65 112.57,35.87 v112,35.3 | v40,35.5 IC15.33
  Layer3 0.203: v40,35.5 42.7,32.8 109.5,32.8 v112,35.3
FTDI_TXD  (via drill 0.35)
  Top 0.203: IC3.1 116.97,53.85 116.13,53.85 arc90 114.2,51.92 114.2,35.32 v113.33,34.45 | IC15.32 v40.8,31.5
  Layer3 0.203: v113.33,34.45 110.38,31.5 v40.8,31.5
GND  (via drill 0.35)
  Top 0.152: Q4.1 88.25,40.55 v88.3,40.5 | R19.1 v88.9,37.5
  Top 0.203: IC12.4 39.51,55.3 v40.1,54.7 | IC13.4 26.91,55.09 v27.4,54.6 | IC1.4 64.5,55.3 v65,54.8 | IC14.4 14.4,56.47 v14.4,54.8 | OSC1.P$2 32.45,28.2 v34,28.2
  Top 0.254: IC11.4 52.1,55.09 52.4,54.8 v53,54.8 | IC6.4 77.2,56.48 77.2,54.8 v78,54.8
  other vias: 96.78,72.32 80.91,20.67 85.27,20.19 93,19.07 97.46,20.19 101.53,20.32 105.69,20.32 103.74,49.78 107.67,55.99 114.52,58.4 102.52,63.37 103.95,67.8 109.83,63.2 106.09,64.66 115.16,62.77 121.52,58.7 115.34,52.13 109.98,69.75 118.67,71.68 117.6,69.34 117.33,65.08 110.03,65.38 118.16,76.34 111.46,71.22 114.3,55.47 83.79,25.37 115.52,70.96 107.29,60.25 76.42,1.76 89.2,1.82 94.83,1.82 106.54,1.82 98.42,7.57 108.33,4.57 115.95,4.57 121.39,1.89 121.59,8 121.59,19.74 121.59,13.34 98.3,29.08 95.36,27.87 91.59,27.25 103.89,29.69 108.97,25.78 108.2,29.35 112.11,31.47 115.57,41.77 115.47,48.2 121.59,26.92 121.59,32.64 121.39,44.78 121.39,51.69 121.59,37.97 121.19,69.81 121.19,77.73 121.39,63.21 116.97,31.4 89.26,20.31 118.61,58.11 87.38,26.67 61.5,51.6 4,53.8 81.2,57.6 45.4,29 34,38 55.2,1.8 31,14.8 38.8,19.2 38.2,22.6 30,23.8 30.4,19.8 33.8,21.6 42.2,14.6 63.8,34.2 40,42.8 27.4,45.4 61.6,44.4 36.2,28.8 52.6,28.8 47,47.3 47.1,51.4 39.4,51.6 37.8,12.6 40.6,11.8 43,10 48.4,9.6 45.2,11.6 34.8,9.4 31.2,7.4 61.2,1.8 80.7,29.7 77,28.8 58.1,29.3 61.4,27.1 71.9,27.1 49,38.2 53.2,38.2 61.2,38.2 69,38.2 73.9,38.2 32,32.4 91.8,58 87,58 95.4,57.8 102.4,58 73.9,29.4 59,54.8 70.8,54.8 84.2,63.6 83.8,65.4 85.2,78.6 83.8,73 91.8,78.4 98,78.4 106.8,78.4 94.8,75 104.8,74.8 68.2,29.2 66.8,21.2 77.6,21.2 49.8,14.8 55,17.6 61,17.6 66.8,17.6 71.4,17.6 77.4,17.6 58.4,12.6 64.4,12.6 85.2,14.2 49,1.8 43,1.8 37,1.8 31.2,1.8 25,1.8 19,1.8 13,1.8 7,1.8 3.8,2.4 3.2,7.6 3.2,14 3.2,20 3.2,26 3.2,32 3.2,38 3.2,44 3.4,50 9.8,5 9.8,11.4 9.8,17.4 9.8,23.4 16,13.8 16,19.8 16,25.8 22.4,16.4 22.4,22.4 22.4,28.4 10.4,44.2 9,36.4 16.4,35.2 16.4,41.2 16.4,47.2 71.2,12.6 79.4,12.6 91.4,13 58.8,7.2 52.8,7.2 46.8,7.2 92.6,7.6 85.6,7.6 79.6,7.6 82.6,1.8 100,1.8 114.6,1.8 103.6,7.6 109.2,7.4 114.6,7.6 109.8,20.4 117.8,20.2 113.8,20.6 51.2,40.2 57.6,40.2 54.6,46.8 54.4,43 69.2,39.8 71.2,46.8 80,35 82,34.2 88,34.4 93,34.4 95,34.4 101.2,34.4 108.4,34.4 114.8,34.2 95.2,38.4 93,43.4 94.8,48.2 93,53.4 110.8,37.8 110.4,45 110.8,52.2 103.6,43.2 43.4,27.2 40.4,25.6 42.2,17.6 45.6,24 46,13.2 52.2,20.4 42.4,23.8 48.3,23.6 36.4,34.6 32.4,44.4 26,51.4 15.2,51.4
  pour Top (rank 6): 2.6,2.6 4,1.2 121.6,1.2 122.2,1.8 122.2,77.8 120.8,79.2 83.4,79.2 83.4,60.4 78.2,55.2 4,55.2 2.4,53.6
  pour Bottom (rank 6): 2.6,2.6 4,1.2 121.6,1.2 122.2,1.8 122.2,77.8 120.8,79.2 83.4,79.2 83.4,60.4 78.2,55.2 4,55.2 2.4,53.6
  pour Layer2 (rank 6): 2.6,2.6 4,1.2 121.6,1.2 122.2,1.8 122.2,77.8 120.8,79.2 83.4,79.2 83.4,60.4 78.2,55.2 4,55.2 2.4,53.6
  pour Layer3 (rank 6): 2.6,2.6 4,1.2 121.6,1.2 122.2,1.8 122.2,77.8 120.8,79.2 83.4,79.2 83.4,60.4 78.2,55.2 4,55.2 2.4,53.6
GND_ISO  (via drill 0.35)
  other vias: 78.1,61.9 73.1,66.2 71.9,63 77.3,69 73.9,72.8 72.5,78 77.9,78 71.3,71.2 77.8,72.8
  pour Layer2: 78.6,79.6 78.6,61.4 70.4,61.4 70.4,79.6
  pour Layer3: 78.6,79.6 78.6,61.4 70.4,61.4 70.4,79.6
  pour Top: 70.4,79.6 70.4,61.4 78.6,61.4 78.6,79.6
  pour Bottom: 78.6,79.6 78.6,61.4 70.4,61.4 70.4,79.6
GND_ISO1  (via drill 0.35)
  other vias: 65.5,61.9 60.3,78.8 64.7,78.4 58.5,73.2 61.9,71.2 64.5,69.2 60.3,65.8 59.3,62.8 65.2,73.2
  pour Layer3: 66,79.6 66,61.4 57.8,61.4 57.8,79.6
  pour Layer2: 66,79.6 66,61.4 57.8,61.4 57.8,79.6
  pour Bottom: 57.8,79.6 57.8,61.4 66,61.4 66,79.6
  pour Top: 57.8,79.6 57.8,61.4 66,61.4 66,79.6
GND_ISO2  (via drill 0.35)
  other vias: 53,61.9 46.9,62.8 48.1,65.8 52.3,68.8 49.3,71.4 46.1,72.8 52.3,78.2 47.7,78.8 52.6,72.8
  pour Layer2: 53.4,79.6 53.4,61.4 45.4,61.4 45.4,79.6
  pour Bottom: 53.4,79.6 53.4,61.4 45.4,61.4 45.4,79.6
  pour Top: 45.4,79.6 45.4,61.4 53.4,61.4 53.4,79.6
  pour Layer3: 45.4,79.6 45.4,61.4 53.4,61.4 53.4,79.6
GND_ISO3  (via drill 0.35)
  other vias: 40.5,62 35.1,78.6 40.1,78.6 34.3,72.8 36.7,71.4 39.7,68.6 35.5,65.8 34.5,62.8 40,72.8
  pour Layer2: 41,79.6 41,61.4 33,61.4 33,79.6
  pour Layer3: 41,79.6 41,61.4 33,61.4 33,79.6
  pour Bottom: 41,79.6 41,61.4 33,61.4 33,79.6
  pour Top: 33,79.6 33,61.4 41,61.4 41,79.6
GND_ISO4  (via drill 0.35)
  other vias: 27.8,61.8 22.7,78.6 26.9,78.4 21.5,71.6 24.1,72.8 26.9,69 22,63.8 23,66 27.4,73
  pour Layer2: 28.2,79.6 28.2,61.4 20.4,61.4 20.4,79.6
  pour Layer3: 28.2,79.6 28.2,61.4 20.4,61.4 20.4,79.6
  pour Top: 20.4,79.6 20.4,61.4 28.2,61.4 28.2,79.6
  pour Bottom: 28.2,79.6 28.2,61.4 20.4,61.4 20.4,79.6
GND_ISO5  (via drill 0.35)
  other vias: 8.6,72.6 15.5,61.9 9.2,62.8 10.3,65.8 14.5,69.4 11.5,72.2 10.3,78.8 14.7,78.2 15,72.8
  pour Layer2: 15.8,79.6 15.8,61.4 7.8,61.4 7.8,79.6
  pour Layer3: 15.8,79.6 15.8,61.4 7.8,61.4 7.8,79.6
  pour Bottom: 15.8,79.6 15.8,61.4 7.8,61.4 7.8,79.6
  pour Top: 7.8,79.6 7.8,61.4 15.8,61.4 15.8,79.6
IDC_CLOCK_OUT  (via drill 0.35)
  Top 0.203: R11.1 v27.2,43.1
  Layer2 0.203: v27.2,43.1 27.2,7.9 v27.1,7.8
  Layer3 0.203: v27.1,7.8 22.76,7.8 SV1.2
LED_CLK_0
  Top 0.203: R21.1 82.09,23.98 80.44,22.33 52.63,22.33 50.4,20.1 48.1,20.1 47.2,21 IC15.10
LED_CLK_1
  Top 0.203: R27.1 86.66,24.76 84.99,26.42 82.92,26.42 79.7,23.2 52.3,23.2 49.95,20.85 48.4,20.85 48,21.25 IC15.11
LED_CLK_2
  Top 0.203: R22.1 90.72,26.52 89.74,27.5 82.5,27.5 79,24 IC15.12
LED_CLK_3
  Top 0.203: R28.1 94.78,26.79 93.57,28 82,28 78.8,24.8 52,24.8 51.5,24.8 IC15.13
LED_CLK_4
  Top 0.203: R23.1 98.85,27.28 97.04,29.08 82,29.08 78.52,25.6 IC15.14
LED_CLK_5
  Top 0.203: R29.1 102.91,29.06 102,29.97 81.97,29.97 78.4,26.4 IC15.15
LED_LOCK
  Top 0.203: 106.79,24.23 106.79,29.57 105.62,30.73 56.97,30.73 55.12,32.58 47.69,32.58 47.42,32.85 47.42,33.53 IC15.24
  Top 0.254: R24.1 106.79,24.23
LED_PWR  (via drill 0.35)
  Top 0.203: R25.1 v115.17,30.4 | IC15.20 v51.5,30.4
  Layer3 0.203: v115.17,30.4 114.77,30.8 51.9,30.8 v51.5,30.4
LED_REP
  Top 0.203: R30.1 111.11,30.58 110.2,31.5 57.4,31.5 54.9,34 48.25,34 IC15.23
N$1
  Top 0.305: R24.2 108.35,22.13 T10.1
N$2
  Top 0.152: Q6.2 91.35,40.4 | 91.35,40.4 R17.1 | Q4.3 88.15,42.45 90.2,40.4 91.35,40.4
N$3
  Top 0.203: R12.2 28.85,15.2 IC16.4
N$4
  Top 0.203: R10.2 43.85,8.7 IC18.4
N$5
  Top 0.203: CLKOUT0.1 77.68,75 76.4,75 75.83,74.44 IC6.6 75.83,60.23 75.6,60 73.4,60 73.3,60.1 IC6.8 70.53,61.42 C26.1
N$6
  Top 0.203: CLKOUT1.1 63.8,75.25 63.23,74.68 IC1.6 63.23,60.23 63,60 60.8,60 60.7,60.1 IC1.8 57.92,61.42 C13.1
N$7
  Top 0.305: T10.3 107.7,18.69 108.35,18.04 R36.2
N$8
  Top 0.203: R11.2 30.35,43.3 IC7.4
N$9
  cutout Top: 93.95,60.31 93.95,61.33 95.17,61.33 95.17,60.31
N$10
  Top 0.152: 92,44 Q6.3
  Top 0.203: 92,44 93,45 96.55,45 U1.4
N$11
  Top 0.203: CLKOUT2.1 51.4,75.25 50.84,74.68 IC11.6 50.84,60.23 50.6,60 48.4,60 48.3,60.1 IC11.8 45.52,61.42 C15.1
N$12
  cutout Top: 106.65,53.21 106.65,54.23 107.97,54.23 107.97,53.21
N$13
  cutout Top: 116.23,71.22 116.23,72.64 117.35,72.64 117.35,71.22
N$14
  cutout Top: 85.05,40.81 85.05,42.23 87.97,42.23 87.97,40.81
N$15
  Top 0.305: R22.2 92.02,21.83 T6.1
N$16
  Top 0.203: U1.5 96.6,41.05 R13.2
N$17
  Top 0.305: R21.2 83.89,21.83 T4.1
N$18
  Top 0.305: R42.1 102.91,16.16 103.83,15.24 103.83,9.05 LED3.C1
N$19
  Top 0.305: T4.3 83.24,18.69 83.89,18.04 R33.2
N$20
  Top 0.305: R27.2 87.95,21.83 T5.1
N$21
  Top 0.305: T6.3 91.37,18.69 92.02,18.04 R34.2
N$22
  Top 0.305: T5.3 87.31,18.69 87.95,18.04 R40.2
N$23  (via drill 0.35)
  Top 0.305: R35.1 98.85,16.35 v98.75,16.26
  Layer2 0.305: v98.75,16.26 103.43,16.26 104.04,15.65 104.04,13.93 LED3.C2
N$24
  Top 0.305: R28.2 96.08,21.83 T7.1
N$25
  Top 0.305: T7.3 95.43,18.69 96.08,18.04 R41.2
N$26
  Top 0.305: R23.2 100.15,21.83 T8.1
N$27
  Top 0.305: T8.3 99.5,18.69 100.15,18.04 R35.2
N$28
  Top 0.305: R29.2 104.21,21.83 T9.1
N$29
  Top 0.305: T9.3 103.56,18.69 104.21,18.04 R42.2
N$30  (via drill 0.35)
  Top 0.305: R33.1 82.7,17.36 v82.7,16.05
  Layer2 0.305: LED1.C2 92.13,15.17 83.58,15.17 v82.7,16.05
N$31  (via drill 0.35)
  Top 0.305: R34.1 90.72,16.8 v91.26,16.26
  Layer2 0.305: v91.26,16.26 97.53,16.26 98.15,15.64 98.15,14.49 LED2.C2
N$32
  Top 0.305: LED1.C1 95.2,6.22 93.8,7.62 93.8,12.48 91.6,14.68 87.66,14.68 86.66,15.68 R40.1
N$33
  Top 0.305: R41.1 94.78,16.16 95.3,15.65 97.54,15.65 98.35,14.83 98.35,9.2 LED2.C1
N$34
  Top 0.305: R30.2 112.41,22.13 T11.1
N$35
  Top 0.203: R14.2 62.3,36.95 Q3.B
N$36
  Top 0.305: R15.2 71.8,36 Q3.C
N$37
  Top 0.203: CLKOUT3.1 38.8,75.25 38.23,74.68 IC12.6 38.23,60.23 38,60 35.8,60 35.7,60.1 IC12.8 33.12,61.42 C17.1
N$38
  Top 0.305: C7.1 107.78,61.04 IC3.17
N$39
  cutout Top: 90.65,41.01 90.65,42.03 93.37,42.03 93.37,41.01
N$40
  Top 0.254: 113.79,72.69 113.79,70.71 114.34,70.17 IC2.P$1
  Top 0.305: USB.P$2 113.79,72.69
N$41
  Top 0.203: R3.1 93.69,68.28 R2.2
  Top 0.305: CLKIN.1 90.43,70.57 92.6,68.4 93.81,68.4 R2.2
N$42
  Top 0.305: IC5.5 94.98,71.37 | R2.1 95.17,71.18 C24.1
  Top 0.508: 94.98,71.37 arc-90 C24.1
N$43
  Top 0.203: R9.1 51.2,10.65 68.35,10.65 69.3,9.7 TEST.2
N$44
  cutout Top: 78.8,47.2 78.8,49.2 77.2,49.2 77.2,47.2
N$45
  Top 0.203: CLKOUT4.1 26,75.25 25.64,74.88 IC13.6 25.64,60.23 25.4,60 23.4,60 23.09,60.3 IC13.8 20.52,61.42 C19.1
N$46
  cutout Top: 97.05,40.21 97.05,41.43 97.97,41.43 97.97,40.21
N$47
  Top 0.305: T11.3 111.76,18.69 112.41,18.04 R44.2
N$48
  cutout Top: 95.85,42.41 95.85,45.43 99.57,45.43 99.57,42.41
N$49
  Top 0.203: CLKOUT5.1 13.85,75.25 13.23,74.64 IC14.6 13.23,60.23 13,60 10.8,60 10.7,60.1 IC14.8 8.12,61.42 C21.1
N$50
  Top 0.254: USB.P$3 112.98,70.71 112.44,70.17 IC2.P$3
N$51
  cutout Top: 73.25,41.41 73.25,47.23 78.77,47.23 78.77,41.41
N$52
  cutout Top: 68.5,45.5 68.5,48.4 66.8,48.4 66.8,45.5
N$53
  Top 0.305: R25.2 116.47,22.13 T12.1
N$54
  Top 0.305: T12.3 115.82,18.69 116.47,18.04 R37.2
N$55
  cutout Top: 62.1,46.5 62.1,47.9 60,47.9 60,46.5
N$56
  Top 0.305: R31.2 120.54,22.13 T13.1
N$57
  cutout Top: 66.2,42.2 66.2,43.6 64.6,43.6 64.6,42.2
N$58
  cutout Top: 66.8,34.4 66.8,37.6 65,37.6 65,34.4
N$59
  Top 0.508: C2.1 119.85,73.45 USB.SHIELD_4
N$60
  Top 0.305: T13.3 119.89,18.69 120.54,18.04 R45.2
N$61
  Top 0.508: R1.1 119.86,78.75 USB.SHIELD_1
N$62
  Top 0.305: R45.1 119.24,8.14 LED5.C1
N$63
  Top 0.305: R37.1 115.17,13.45 LED5.C2
N$64
  cutout Top: 65,37.4 61.4,37.4 61.4,35.4 65,35.4
N$65  (via drill 0.35)
  Top 0.305: R36.1 107.05,16.09 v107.09,16.05
  Layer2 0.305: v107.09,16.05 108.92,16.05 109.53,15.44 109.53,13.77 LED4.C2
N$66
  Top 0.305: R44.1 111.11,16.42 110.34,15.65 110.34,7.88 LED4.C1
N$67
  cutout Layer3: 24.41,12.42 24.41,6.9 11.61,6.9 11.61,9.13 13.91,9.13 13.76,12.42
N$68
  cutout Top: 45.4,46.6 45.4,44.2 48.4,44.2 48.4,46.6
N$69
  cutout Top: 77.4,33.8 77.4,37.2 73,37.2 73,33.8
N$70
  cutout Top: 101.35,30.78 102.36,30.78 102.36,29.72 101.35,29.72
N$71
  cutout Top: 110.36,31.13 110.36,31.89 111.07,31.89 111.07,31.13
N$72
  cutout Top: 96.32,30.18 97.33,30.18 97.33,28.96 96.32,28.96
N$73
  cutout Top: 93.47,29.21 94.23,29.21 94.23,28.24 93.47,28.24
N$74
  cutout Top: 88.85,28.7 89.87,28.7 89.87,27.48 88.85,27.48
N$75
  cutout Top: 82.09,26.62 82.85,26.62 82.85,24.4 82.09,24.4
N$76
  cutout Top: 61.3,47.3 59.9,47.3 59.9,45.4 61.3,45.4
N$77
  cutout Top: 85.65,27.69 86.01,27.69 86.01,26.07 85.65,26.07
N$78
  cutout Top: 33.2,26.8 33.2,31.4 29.4,31.4 29.4,26.8
N$79
  cutout Top: 105.36,30.53 105.36,31.29 106.07,31.29 106.07,30.53
N$80
  cutout Top: 37.2,46.7 37.2,44.2 40.2,44.2 40.2,46.7
N$81
  cutout Top: 35.1,24.7 33,26.1 33,24.7
N$82
  cutout Top: 49.4,22.1 49.4,24.3 47.64,22.1
N$83
  cutout Top: 41.8,18 44.6,18 44.6,19.8 43.6,19.8
N$84
  cutout Layer2: 6.2,34.2 11,34.2 11,28.6 9.2,28.6 9.2,26.4 6.2,26.4
N$85
  cutout Top: 28.8,48 28.8,45.5 30.2,45.5 30.2,48
N$86
  cutout Top: 28.9,43.7 28.9,42.5 30.1,42.5 30.1,43.7
N$87
  cutout Top: 82.75,16.92 82.75,18.03 83.97,18.03 83.97,16.92
N$88
  cutout Top: 86.77,16.92 86.77,18.03 87.99,18.03 87.99,16.92
N$89
  cutout Top: 90.88,18.14 92,18.14 92,16.92 90.88,16.92
N$90
  cutout Top: 94.84,16.92 94.84,18.03 96.06,18.03 96.06,16.92
N$91
  cutout Top: 98.96,16.92 98.96,18.03 100.18,18.03 100.18,16.92
N$92
  cutout Top: 103.02,16.92 103.02,18.03 104.24,18.03 104.24,16.92
N$93
  cutout Top: 107.14,16.92 107.14,18.03 108.36,18.03 108.36,16.92
N$94
  cutout Top: 111.2,16.92 111.2,18.03 112.42,18.03 112.42,16.92
N$95
  cutout Top: 115.16,16.92 115.16,18.03 116.38,18.03 116.38,16.92
N$96
  cutout Top: 119.28,16.92 119.28,18.03 120.5,18.03 120.5,16.92
N$97
  Top 0.203: R8.1 99.2,47.3 99.5,47 99.5,45.05 U1.3
N$98
  cutout Top: 119.33,23.42 119.33,24.54 120.55,24.54 120.55,23.42
N$99
  cutout Top: 115.27,23.42 115.27,24.54 116.48,24.54 116.48,23.42
N$100
  cutout Top: 111.15,23.42 111.15,24.54 112.37,24.54 112.37,23.42
N$101
  cutout Top: 107.14,23.42 107.14,24.54 108.36,24.54 108.36,23.42
N$102
  cutout Top: 103.02,23.42 103.02,24.54 104.24,24.54 104.24,23.42
N$103
  cutout Top: 98.96,23.42 98.96,24.54 100.18,24.54 100.18,23.42
N$104
  cutout Top: 94.79,23.42 94.79,24.54 96.01,24.54 96.01,23.42
N$105
  cutout Top: 90.78,23.42 90.78,24.54 92,24.54 92,23.42
N$106
  cutout Top: 86.72,23.42 86.72,24.54 87.93,24.54 87.93,23.42
N$107
  cutout Top: 82.65,23.42 82.65,24.54 83.87,24.54 83.87,23.42
N$108
  cutout Top: 29,49.7 29,48.5 30.2,48.5 30.2,49.7
N$109
  cutout Top: 89.26,60.09 85.05,60.09 85.05,61.01 89.26,61.01
N$110
  cutout Top: 120.14,55.12 120.14,56.44 120.9,56.44 120.9,55.17 120.9,55.12
N$111
  cutout Top: 98.06,60.14 98.06,61.26 96.38,61.26 96.38,60.14
N$112
  cutout Top: 91.55,61.31 91.55,62.33 92.77,62.33 92.77,61.31
N$113
  Top 0.203: Q1.3 69.65,45.9 R4.1
N$116
  Top 0.203: Q2.C 64.05,47.9 R7.2 Q1.2
N$117
  cutout Top: 116.33,53.34 111.51,53.34 111.51,56.64 116.33,56.64
N$118
  Top 0.203: R6.2 59.45,47.65 60.2,46.9 60.2,46.25 Q2.B
N$119
  cutout Top: 55.8,30.4 57.2,30.4 57.2,31.4 56.8,31.4
N$120
  cutout Top: 34.8,45.5 34.8,44.3 36,44.3 36,45.5
N$121
  cutout Top: 27.5,22.6 27.5,15.4 28.6,15.4 28.6,22.6
N$123
  cutout Top: 34.2,13 34.2,10.9 37.3,10.9 37.3,13
N$124
  cutout Top: 81.16,29.73 81.16,30.49 81.87,30.49 81.87,29.73
N$125
  cutout Top: 6.2,34.2 11,34.2 11,28.6 9.2,28.6 9.2,26.4 6.2,26.4
N$126
  cutout Layer3: 6.2,34.2 11,34.2 11,28.6 9.2,28.6 9.2,26.4 6.2,26.4
N$127
  cutout Bottom: 6.2,34.2 11,34.2 11,28.6 9.2,28.6 9.2,26.4 6.2,26.4
N$128
  cutout Layer2: 24.41,12.42 24.41,6.9 11.61,6.9 11.61,9.13 13.91,9.13 13.76,12.42
N$129
  cutout Top: 45.6,33 45.6,31.6 46.6,31.6 46.6,32
N$130
  cutout Top: 119.38,77.72 119.38,78.99 120.5,78.99 120.5,77.72
N$131
  cutout Top: 119.33,73.25 119.33,74.52 120.45,74.52 120.45,73.25
N$132
  cutout Top: 116.48,66.6 116.48,67.87 117.6,67.87 117.6,66.6
N$133
  cutout Top: 112.88,69.8 112.88,70.21 114,70.21 114,69.8
N$134
  cutout Top: 113.69,69.95 113.69,71.37 114.81,71.37 114.81,69.95
N$135
  cutout Top: 112.01,70 112.01,72.24 113.13,72.24 113.13,70
N$136
  cutout Top: 103.78,59.64 103.78,60.91 105.92,60.91 105.92,59.64
N$137
  cutout Top: 105.87,58.12 105.87,58.78 107.95,58.78 107.95,58.12
N$138
  cutout Top: 106.73,61.77 106.73,62.64 109.02,62.64 109.02,61.77
N$147
  cutout Top: 24.41,12.42 24.41,6.9 11.61,6.9 11.61,9.13 13.91,9.13 13.76,12.42
N$150  (via drill 0.35)
  other vias: 115.06,54.23
N$162
  cutout Bottom: 24.41,12.42 24.41,6.9 11.61,6.9 11.61,9.13 13.91,9.13 13.76,12.42
N$175  (via drill 0.35)
  Top 0.203: 119.78,59.74 v118.36,59.74 | v111.76,59.74 IC3.19
  Top 0.254: R18.2 119.78,59.74
  Layer3 0.203: v111.76,59.74 v118.36,59.74
N$183
  cutout Top: 81.74,19.81 84.73,19.81 84.73,23.62 82.91,23.62 82.91,20.83 81.74,20.83
N$184
  cutout Top: 85.8,19.81 88.8,19.81 88.8,23.62 86.97,23.62 86.97,20.83 85.8,20.83
N$185
  cutout Top: 89.87,19.81 92.86,19.81 92.86,23.62 91.03,23.62 91.03,20.83 89.87,20.83
N$186
  cutout Top: 93.93,19.81 96.93,19.81 96.93,23.62 95.1,23.62 95.1,20.83 93.93,20.83
N$187
  cutout Top: 97.99,19.81 100.99,19.81 100.99,23.62 99.16,23.62 99.16,20.83 97.99,20.83
N$188
  cutout Top: 102.06,19.81 105.05,19.81 105.05,23.62 103.23,23.62 103.23,20.83 102.06,20.83
N$189
  cutout Top: 106.22,19.81 109.22,19.81 109.22,23.62 107.39,23.62 107.39,20.83 106.22,20.83
N$190
  cutout Top: 110.29,19.81 113.28,19.81 113.28,23.62 111.46,23.62 111.46,20.83 110.29,20.83
N$191
  cutout Top: 114.35,19.76 117.35,19.76 117.35,23.57 115.52,23.57 115.52,20.78 114.35,20.78
N$192
  cutout Top: 118.41,19.81 121.41,19.81 121.41,23.62 119.58,23.62 119.58,20.83 118.41,20.83
OSC1
  Top 0.203: OSC1.P$3 32.65,30.1 33.15,29.6 IC15.37
PDI-CLK  (via drill 0.35)
  Top 0.203: IC15.35 36.25,31.2 35.85,30.8 v35.8,30.8
  Layer3 0.203: PDI.5 8.67,29 11.2,29 13,30.8 v35.8,30.8
PDI-DATA  (via drill 0.35)
  Top 0.203: IC15.34 36.6,32 v36,32.6
  Layer3 0.203: PDI.1 8.67,31.6 35,31.6 v36,32.6
PWR_GOOD  (via drill 0.35)
  Top 0.203: U2.6 75.36,40.87 v74.6,40.1 | v42.4,19 IC15.4
  Layer3 0.203: v75.3,18.9 42.5,18.9 v42.4,19
  Bottom 0.203: v74.6,40.1 74.6,19.6 v75.3,18.9
RX
  Top 0.203: IC10.2 35.74,10.71 R16.1 34.6,6.5 18.5,6.5 17.61,7.39 SV1.6
STATE
  Top 0.203: R31.1 119.24,30.62 117.64,32.22 57.48,32.22 54.2,35.5 47,35.5 46.4,34.9 IC15.25
TX  (via drill 0.35)
  Top 0.203: R10.1 42.35,8.4 42.4,8.35 v42.4,6.4
  Layer3 0.203: v42.4,6.4 20.6,6.4 20.15,6.85 SV1.4
UC_RX
  Top 0.203: IC15.2 40.8,18.25 40.3,17.75 40.3,13.8 39.81,13.31 IC10.4
UC_TX
  Top 0.203: IC15.3 41.6,18.1 41,17.5 41,13 41.5,12.5 IC18.2
USBDM
  Top 0.305: C6.1 117.04,66.65 114.2,66.65 114.2,66.05 IC2.P$6
  Top 0.406: IC2.P$6 114.4,65.85 114.4,63.7 arc-90 112.39,61.69 IC3.16
USBDP
  Top 0.305: C4.1 110.13,66.65 112.57,66.65 112.57,66.05 IC2.P$4
  Top 0.406: IC2.P$4 112.44,63.67 arc-90 111.11,62.34 IC3.15
V_BATT  (via drill 0.35)
  Top 0.203: R7.1 Q1.1 66.6,46.3 v66.6,45.2 | U2.2 76.64,45.84 v76.6,45.8
  Top 0.305: X1.2 89.43,47.3 R8.2 97.2,47.35 BAT_TP.TP | X1.2 87.23,49.5 77.5,49.5 76.64,48.63 U2.2 | R15.1 79.2,35.6 80.5,36.9 80.5,45.6 81.33,46.43 86.7,46.43 X1.2
  Layer3 0.203: v76.6,45.8 67.2,45.8 v66.6,45.2
VDD  (via drill 0.35)
  Top 0.203: OSC1.P$4 30.35,33.1 C32.1 | IC15.39 34.85,28 32.55,25.7 C29.1 | IC15.31 41.6,38.75 C28.1 | C27.1 54.55,29.5 49.85,29.5 IC15.19 | IC15.9 46.4,17.35 C22.1
  Top 0.254: F1.1 56.15,38.8 v54.4,38.8 | v30.4,38.8 30.4,33.35 C32.1 | C29.1 32.1,25.85 v32.1,26.7 | C22.1 46.55,16.05 v46.6,16 54,16 55.05,14.95 R48.2 | C27.1 55.05,28.85 v55,28.8 | C28.1 42.75,38.85 42.8,38.8 v42.8,38.83
  Layer2 0.254: v32.1,26.7 33.1,27.7 v33.1,38.83 | v46.6,16 v46.6,38.83 | v55,28.8 55,38.2 v54.4,38.8
  Layer3 0.254: v54.4,38.8 54.37,38.83 v46.6,38.83 v42.8,38.83 v33.1,38.83 30.43,38.83 v30.4,38.8 v10,38.8
  Bottom 0.254: v10,38.8 10,32.87 PDI.2

### Text on the board
tPlace: harp timsestamp / generator v1.0
tNames: FILIPE: / foram feitas alguns add-ons / não envies para produção antes de falarmos / levantaramse-me algumas questões que devemos falar